# EAGLE design Smart_Lock_V1.00 (EAGLE 9.6.2)

## Sheet 1 of 6
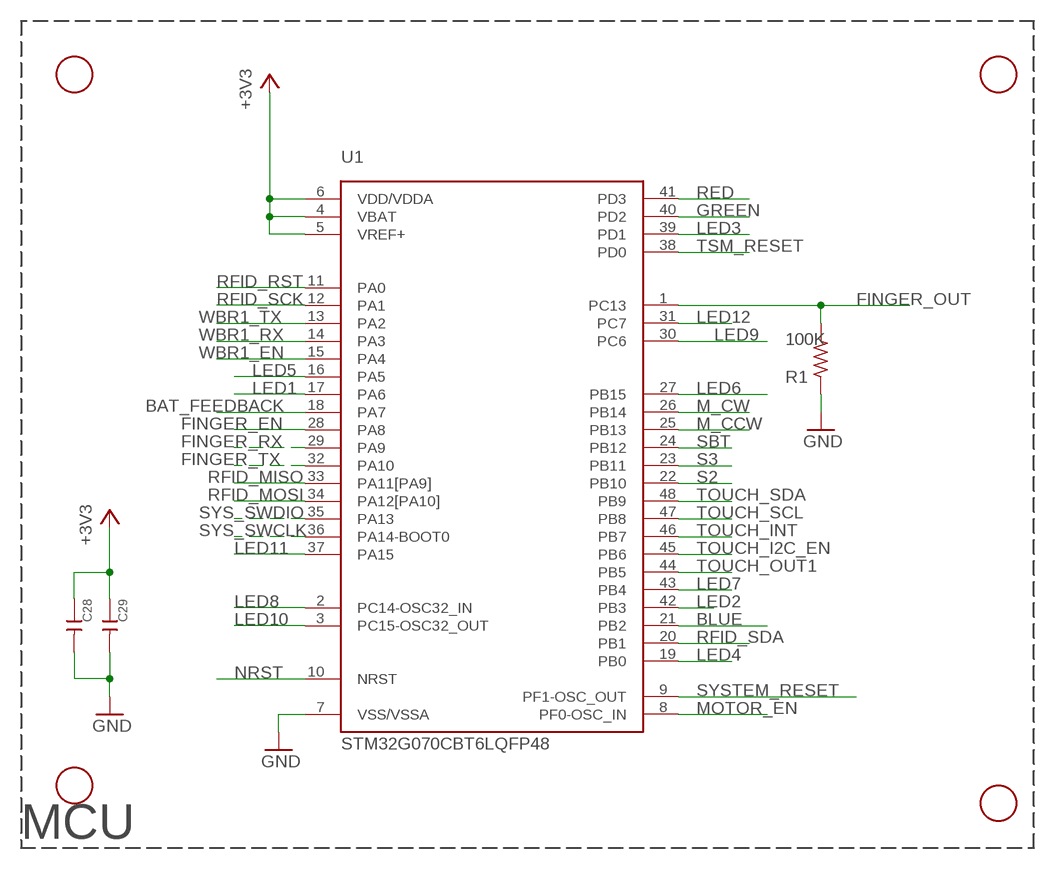
[diagram p0: schematic, sheet 1]

### Parts
C28  100nF  CERAMIC-100NF-50V-10%-X7R(0603)  [C0603]
C29  100nF  CERAMIC-100NF-50V-10%-X7R(0603)  [C0603]
F1  FIDUCIAL  [FIDUCIAL_1MM]
F2  FIDUCIAL  [FIDUCIAL_1MM]
F3  FIDUCIAL  [FIDUCIAL_1MM]
F4  FIDUCIAL  [FIDUCIAL_1MM]
R1  100K  R_0603  [R0603]
U1  STM32G070CBT6LQFP48  [LQFP48]

### Nets
+3V3: C28.1 C29.1 U1.4(VBAT) U1.5(VREF+) U1.6(VDD/VDDA) ; also sheet 2,3,4,5
BAT_FEEDBACK: U1.18(PA7) ; also sheet 4
BLUE: U1.21(PB2) ; also sheet 5
FINGER_EN: U1.28(PA8) ; also sheet 4
FINGER_OUT: R1.1 U1.1(PC13) ; also sheet 4
FINGER_RX: U1.29(PA9) ; also sheet 4
FINGER_TX: U1.32(PA10) ; also sheet 4
GND: C28.2 C29.2 R1.2 U1.7(VSS/VSSA) ; also sheet 2,3,4,5
GREEN: U1.40(PD2) ; also sheet 5
LED1: U1.17(PA6) ; also sheet 5
LED2: U1.42(PB3) ; also sheet 5
LED3: U1.39(PD1) ; also sheet 5
LED4: U1.19(PB0) ; also sheet 5
LED5: U1.16(PA5) ; also sheet 5
LED6: U1.27(PB15) ; also sheet 5
LED7: U1.43(PB4) ; also sheet 5
LED8: U1.2(PC14-OSC32_IN) ; also sheet 5
LED9: U1.30(PC6) ; also sheet 5
LED10: U1.3(PC15-OSC32_OUT) ; also sheet 5
LED11: U1.37(PA15) ; also sheet 5
LED12: U1.31(PC7) ; also sheet 5
M_CCW: U1.25(PB13) ; also sheet 4
M_CW: U1.26(PB14) ; also sheet 4
MOTOR_EN: U1.8(PF0-OSC_IN) ; also sheet 4
NRST: U1.10(NRST) ; also sheet 4
RED: U1.41(PD3) ; also sheet 5
RFID_MISO: U1.33(PA11[PA9]) ; also sheet 3
RFID_MOSI: U1.34(PA12[PA10]) ; also sheet 3
RFID_RST: U1.11(PA0) ; also sheet 3
RFID_SCK: U1.12(PA1) ; also sheet 3
RFID_SDA: U1.20(PB1) ; also sheet 3
S2: U1.22(PB10) ; also sheet 2
S3: U1.23(PB11) ; also sheet 2
SBT: U1.24(PB12) ; also sheet 2
SYS_SWCLK: U1.36(PA14-BOOT0) ; also sheet 4
SYS_SWDIO: U1.35(PA13) ; also sheet 4
SYSTEM_RESET: U1.9(PF1-OSC_OUT) ; also sheet 4
TOUCH_I2C_EN: U1.45(PB6) ; also sheet 2
TOUCH_INT: U1.46(PB7) ; also sheet 2
TOUCH_OUT1: U1.44(PB5) ; also sheet 2
TOUCH_SCL: U1.47(PB8) ; also sheet 2
TOUCH_SDA: U1.48(PB9) ; also sheet 2
TSM_RESET: U1.38(PD0) ; also sheet 2
WBR1_EN: U1.15(PA4) ; also sheet 4
WBR1_RX: U1.14(PA3) ; also sheet 4
WBR1_TX: U1.13(PA2) ; also sheet 4

### Notes on the sheet
- MCU

## Sheet 2 of 6
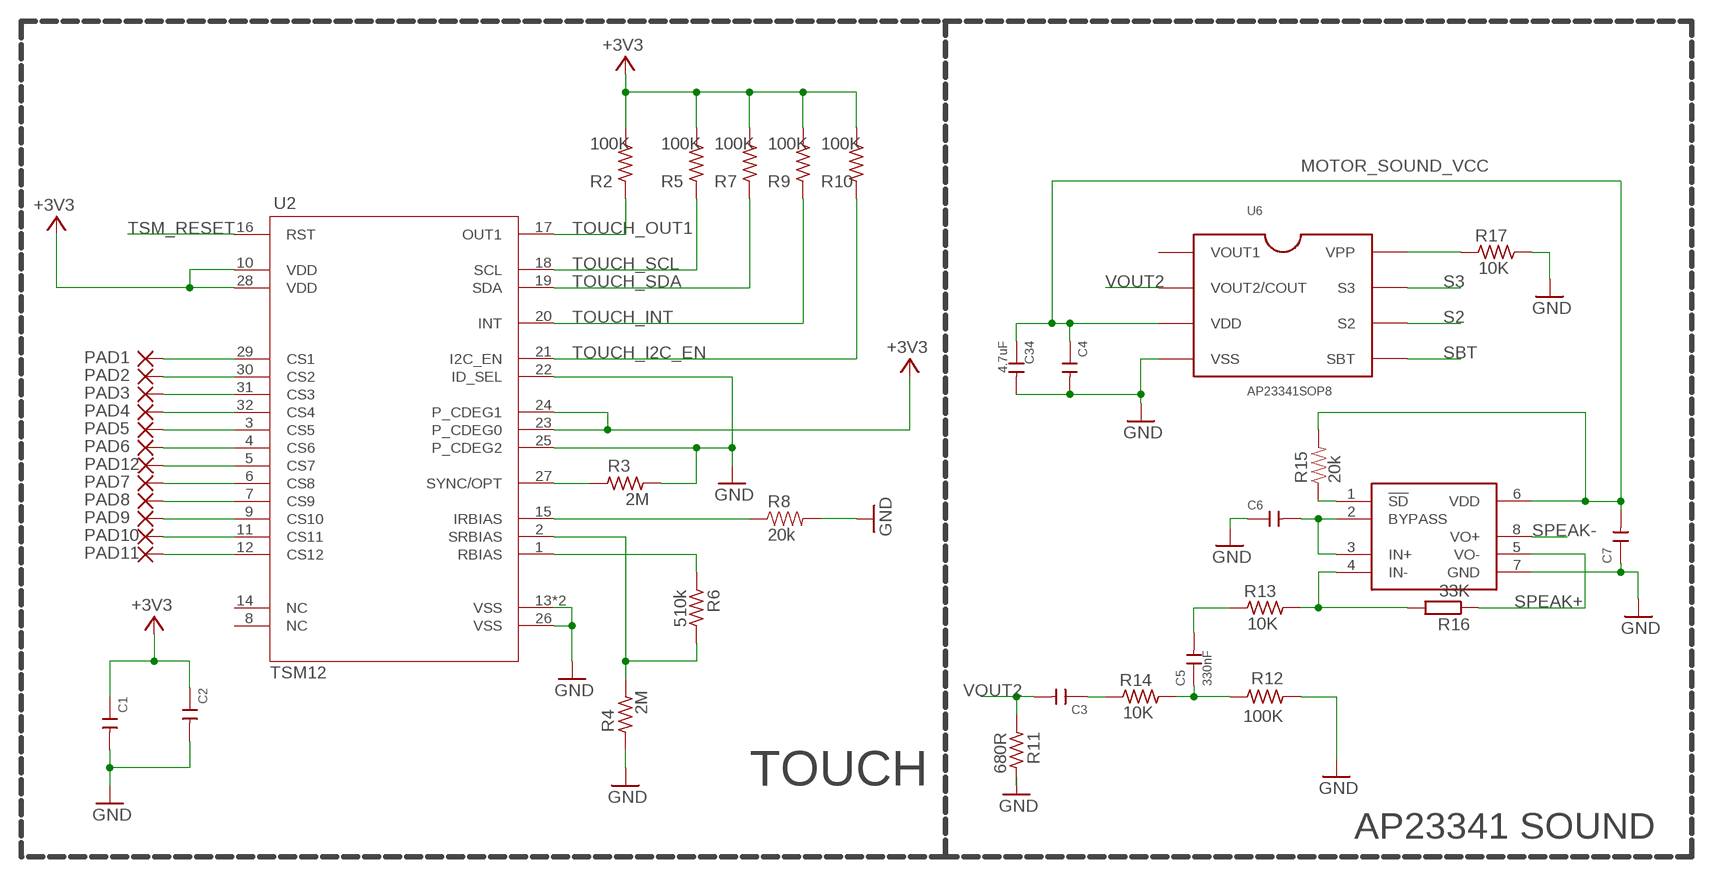
[diagram p1: schematic, sheet 2]

### Parts
C1  1uf  CERAMIC-1UF-25V-10%-X7R(0603)  [C0603]
C2  100nF  CERAMIC-100NF-50V-10%-X7R(0603)  [C0603]
C3  100nF  CERAMIC-100NF-50V-10%-X7R(0603)  [C0603]
C4  100nF  CERAMIC-100NF-50V-10%-X7R(0603)  [C0603]
C5  330nF  CERAMIC-10PF-50V-5%-NPO(0603)  [C0603]
C6  1uf  CERAMIC-1UF-25V-10%-X7R(0603)  [C0603]
C7  1uf  CERAMIC-1UF-25V-10%-X7R(0603)  [C0603]
C34  4.7uF  CERAMIC-10PF-50V-5%-NPO(0603)  [C0603]
PAD1  WIREPADSMD1,27-254  [SMD1,27-2,54]
PAD2  WIREPADSMD1,27-254  [SMD1,27-2,54]
PAD3  WIREPADSMD1,27-254  [SMD1,27-2,54]
PAD4  WIREPADSMD1,27-254  [SMD1,27-2,54]
PAD5  WIREPADSMD1,27-254  [SMD1,27-2,54]
PAD6  WIREPADSMD1,27-254  [SMD1,27-2,54]
PAD7  WIREPADSMD1,27-254  [SMD1,27-2,54]
PAD8  WIREPADSMD1,27-254  [SMD1,27-2,54]
PAD9  WIREPADSMD1,27-254  [SMD1,27-2,54]
PAD10  WIREPADSMD1,27-254  [SMD1,27-2,54]
PAD11  WIREPADSMD1,27-254  [SMD1,27-2,54]
PAD12  WIREPADSMD1,27-254  [SMD1,27-2,54]
R2  100K  R_0603  [R0603]
R3  2M  R_0603  [R0603]
R4  2M  R_0603  [R0603]
R5  100K  R_0603  [R0603]
R6  510k  R_0603  [R0603]
R7  100K  R_0603  [R0603]
R8  20k  20KOHM-0603-1/10W-5%  [0603]
R9  100K  R_0603  [R0603]
R10  100K  R_0603  [R0603]
R11  680R  R_0603  [R0603]
R12  100K  R_0603  [R0603]
R13  10K  R_0603  [R0603]
R14  10K  R_0603  [R0603]
R15  20k  20KOHM-0603-1/10W-5%  [0603]
R16  33K  R-EU_R0603  [R0603]
R17  10K  R_0603  [R0603]
U2  TSM12M  [QFN_32_UH]
U6  AP23341SOP8  [SOP8]
U7  AP4890  AP4890RM  [MSOP08]

### Nets
+3V3: C1.1 C2.1 R2.1 R5.1 R7.1 R9.1 R10.1 U2.10(VDD) U2.23(P_CDEG0) U2.24(P_CDEG1) U2.28(VDD) ; also sheet 1,3,4,5
GND: C1.2 C2.2 C4.2 C6.1 C7.1 C34.2 R3.2 R4.1 R8.2 R11.2 R12.2 R17.2 U2.13(VSS) U2.22(ID_SEL) U2.25(P_CDEG2) U2.26(VSS) U2.33(VSS) U6.4(VSS) U7.7(GND) ; also sheet 1,3,4,5
MOTOR_SOUND_VCC: C4.1 C7.2 C34.1 R15.2 U6.3(VDD) U7.6(VDD) ; also sheet 4
N$1: R17.1 U6.8(VPP)
N$2: R15.1 U7.1(!SD)
N$16: PAD3.1(P) U2.31(CS3)
N$23: C6.2 U7.2(BYPASS) U7.3(IN+)
N$25: C5.2 R13.1
N$26: R3.1 U2.27(SYNC/OPT)
N$27: R13.2 R16.2 U7.4(IN-)
N$29: C3.1 R14.1
N$30: PAD4.1(P) U2.32(CS4)
N$31: PAD5.1(P) U2.3(CS5)
N$32: PAD6.1(P) U2.4(CS6)
N$33: PAD2.1(P) U2.30(CS2)
N$34: PAD1.1(P) U2.29(CS1)
N$35: PAD7.1(P) U2.6(CS8)
N$36: PAD9.1(P) U2.9(CS10)
N$37: PAD10.1(P) U2.11(CS11)
N$38: R6.1 U2.1(RBIAS)
N$39: PAD11.1(P) U2.12(CS12)
N$40: R4.2 R6.2 U2.2(SRBIAS)
N$41: PAD12.1(P) U2.5(CS7)
N$42: R8.1 U2.15(IRBIAS)
N$43: PAD8.1(P) U2.7(CS9)
N$45: C5.1 R12.1 R14.2
S2: U6.6(S2) ; also sheet 1
S3: U6.7(S3) ; also sheet 1
SBT: U6.5(SBT) ; also sheet 1
SPEAK+: R16.1 U7.5(VO-) ; also sheet 4
SPEAK-: U7.8(VO+) ; also sheet 4
TOUCH_I2C_EN: R10.2 U2.21(I2C_EN) ; also sheet 1
TOUCH_INT: R9.2 U2.20(INT) ; also sheet 1
TOUCH_OUT1: R2.2 U2.17(OUT1) ; also sheet 1
TOUCH_SCL: R5.2 U2.18(SCL) ; also sheet 1
TOUCH_SDA: R7.2 U2.19(SDA) ; also sheet 1
TSM_RESET: U2.16(RST) ; also sheet 1
VOUT2: C3.2 R11.1 U6.2(VOUT2/COUT)
Unconnected: U2.8(NC) U2.14(NC) U6.1(VOUT1)

### Notes on the sheet
- TOUCH
- AP23341 SOUND

## Sheet 3 of 6
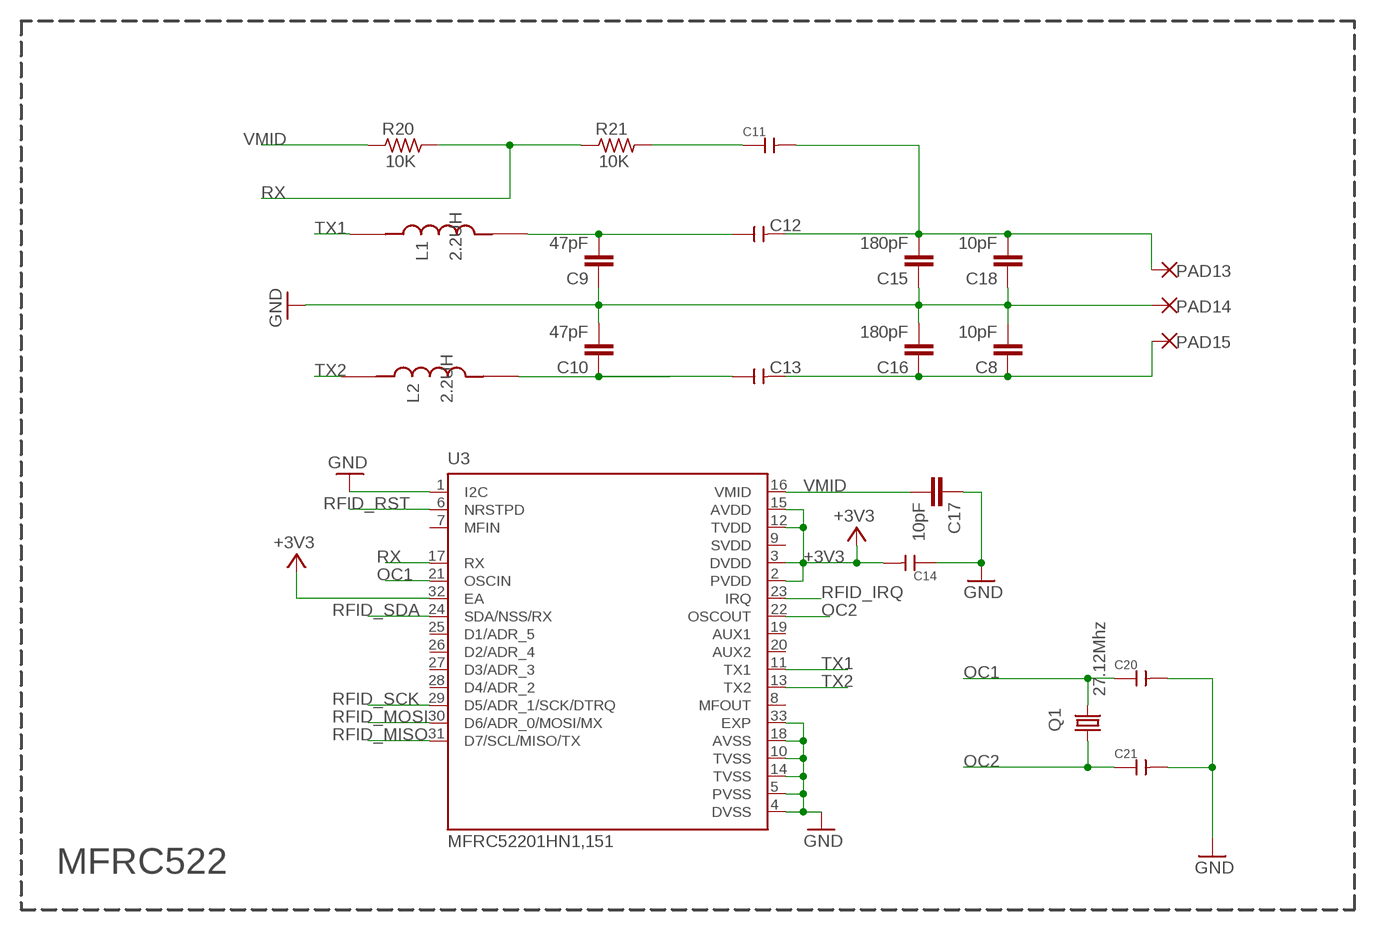
[diagram p2: schematic, sheet 3]

### Parts
C8  10pF  C-EUC0603  [C0603]
C9  47pF  C-EUC0603  [C0603]
C10  47pF  C-EUC0603  [C0603]
C11  100nF  CERAMIC-100NF-50V-10%-X7R(0603)  [C0603]
C12  15pf  CERAMIC-15PF-50V-5%-NPO(0603)  [C0603]
C13  15pf  CERAMIC-15PF-50V-5%-NPO(0603)  [C0603]
C14  100nF  CERAMIC-100NF-50V-10%-X7R(0603)  [C0603]
C15  180pF  C-EUC0603  [C0603]
C16  180pF  C-EUC0603  [C0603]
C17  10pF  C-EUC0603  [C0603]
C18  10pF  C-EUC0603  [C0603]
C20  15pf  CERAMIC-15PF-50V-5%-NPO(0603)  [C0603]
C21  15pf  CERAMIC-15PF-50V-5%-NPO(0603)  [C0603]
L1  2.2UH  MLF2012A2R2MT000  [INDC2012X105N]
L2  2.2UH  MLF2012A2R2MT000  [INDC2012X105N]
PAD13  WIREPADSMD5-1,8  [5-1,8]
PAD14  WIREPADSMD5-1,8  [5-1,8]
PAD15  WIREPADSMD5-1,8  [5-1,8]
Q1  27.12Mhz  KX-6  [2.5X2.0_KX-6]
R20  10K  R_0603  [R0603]
R21  10K  R_0603  [R0603]
U3  MFRC52201HN1,151  [QFN50P500X500X100-33N]

### Nets
+3V3: C14.2 U3.2(PVDD) U3.3(DVDD) U3.12(TVDD) U3.15(AVDD) U3.32(EA) ; also sheet 1,2,4,5
ANT: C11.2 C12.2 C15.2 C18.2 PAD13.1(P)
ANT2: C8.1 C13.2 C16.1 PAD15.1(P)
GND: C8.2 C9.1 C10.2 C14.1 C15.1 C16.2 C17.1 C18.1 C20.2 C21.2 PAD14.1(P) U3.1(I2C) U3.4(DVSS) U3.5(PVSS) U3.10(TVSS) U3.14(TVSS) U3.18(AVSS) U3.33(EXP) ; also sheet 1,2,4,5
N$55: C11.1 R21.2
N$56: C9.2 C12.1 L1.2
N$57: C10.1 C13.1 L2.2
OC1: C20.1 Q1.3 U3.21(OSCIN)
OC2: C21.1 Q1.1 U3.22(OSCOUT)
RFID_IRQ: U3.23(IRQ)
RFID_MISO: U3.31(D7/SCL/MISO/TX) ; also sheet 1
RFID_MOSI: U3.30(D6/ADR_0/MOSI/MX) ; also sheet 1
RFID_RST: U3.6(NRSTPD) ; also sheet 1
RFID_SCK: U3.29(D5/ADR_1/SCK/DTRQ) ; also sheet 1
RFID_SDA: U3.24(SDA/NSS/RX) ; also sheet 1
RX: R20.2 R21.1 U3.17(RX)
TX1: L1.1 U3.11(TX1)
TX2: L2.1 U3.13(TX2)
VMID: C17.2 R20.1 U3.16(VMID)
Unconnected: U3.7(MFIN) U3.8(MFOUT) U3.19(AUX1) U3.20(AUX2) U3.25(D1/ADR_5) U3.26(D2/ADR_4) U3.27(D3/ADR_3) U3.28(D4/ADR_2)

### Notes on the sheet
- MFRC522

## Sheet 4 of 6
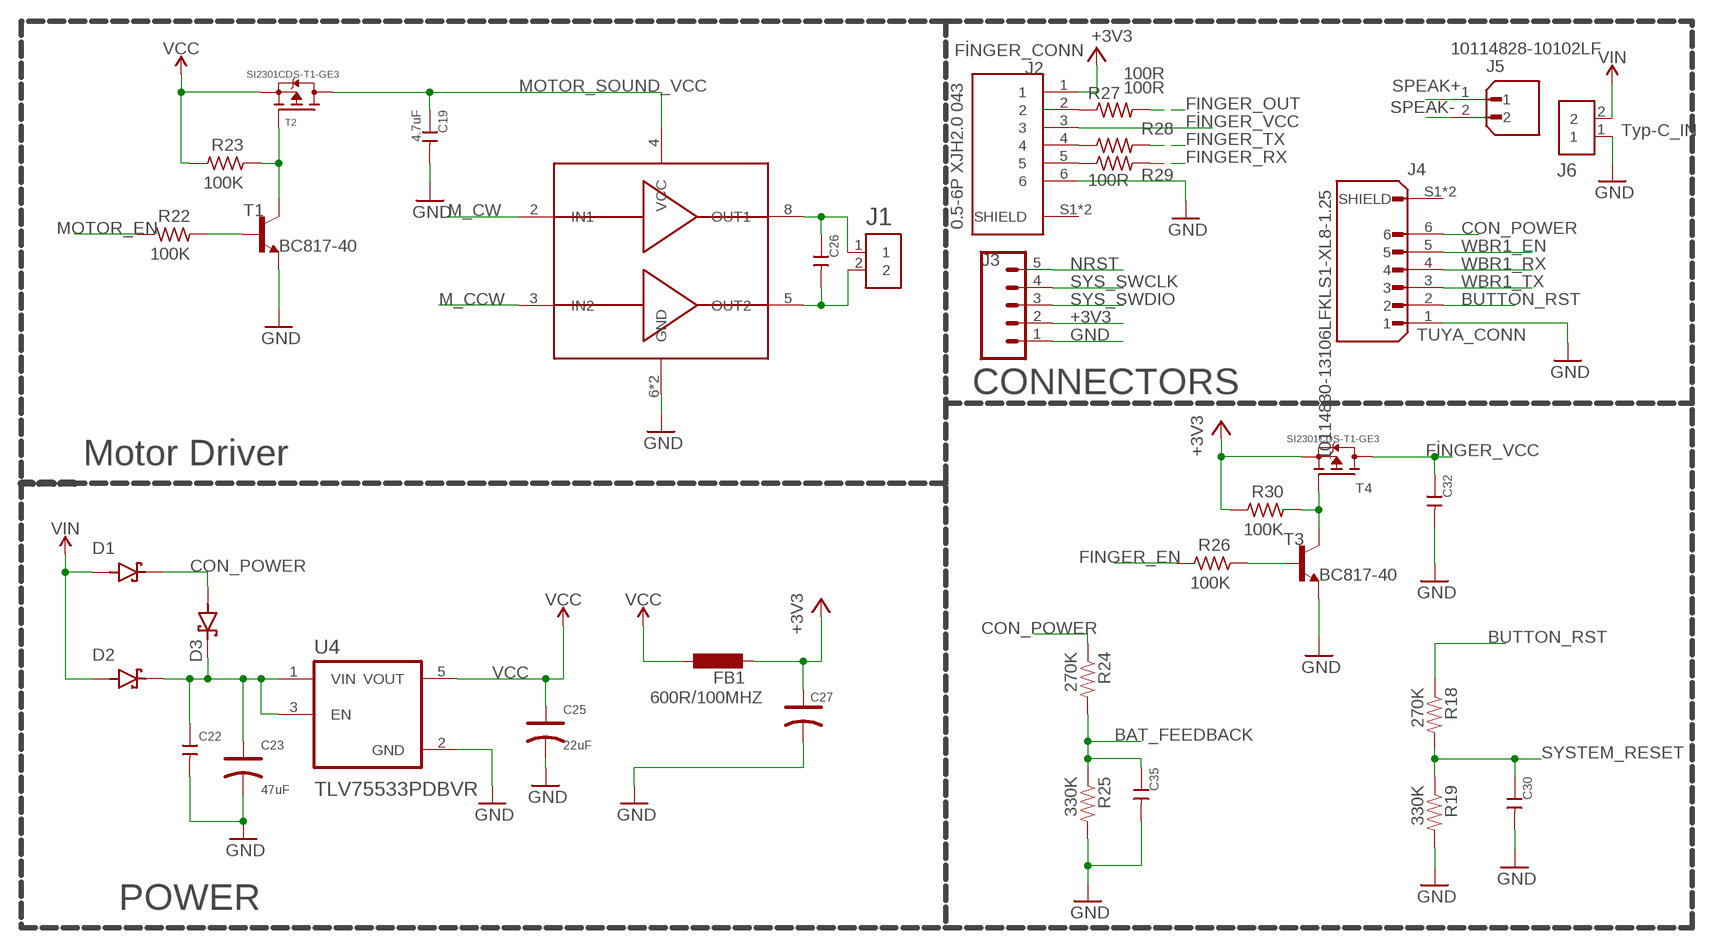
[diagram p3: schematic, sheet 4]

### Parts
C19  4.7uF  CERAMIC-10PF-50V-5%-NPO(0603)  [C0603]
C22  100nF  CERAMIC-100NF-50V-10%-X7R(0603)  [C0603]
C23  47uF  TANTALUM-SMD-47UF-16V-10%(AVX-B)  [AVX-B]
C25  22uF  TANTALUM-SMD-47UF-6.3V-10%(CT1206)  [CT1206]
C26  100nF  CERAMIC-100NF-50V-10%-X7R(0603)  [C0603]
C27  10uf  TANTALUM-SMD-10UF-16V-10%(AVX-B)  [AVX-B]
C30  100nF  CERAMIC-100NF-50V-10%-X7R(0603)  [C0603]
C32  100nF  CERAMIC-100NF-50V-10%-X7R(0603)  [C0603]
C35  100nF  CERAMIC-100NF-50V-10%-X7R(0603)  [C0603]
D1  1N5819HW-7-F  [SOD3715X145N]
D2  1N5819HW-7-F  [SOD3715X145N]
D3  1N5819HW-7-F  [SOD3715X145N]
FB1  600R/100MHZ  L-EUL2012C  [L2012C]
J1  B2B-PH-SM4-TB(LF)(SN)  [B2B-PH-SM4-TB(LF)(SN)]
J2  0.5-6P XJH2.0 043  68710614522  [WE_68710614522]
J3  CONN_05  [1X05]
J4  10114830-13106LFKLS1-XL8-1.25  [1X6PIN_1.25MM]
J5  10114828-10102LF  [AMPHENOL_10114828-10102LF]
J6  B2B-PH-SM4-TB(LF)(SN)  [B2B-PH-SM4-TB(LF)(SN)]
R18  270K  10KOHM-0603-1/10W-1%  [0603]
R19  330K  33KOHM-0603-1/10W-1%  [0603]
R22  100K  R_0603  [R0603]
R23  100K  R_0603  [R0603]
R24  270K  10KOHM-0603-1/10W-1%  [0603]
R25  330K  33KOHM-0603-1/10W-1%  [0603]
R26  100K  R_0603  [R0603]
R27  100R  R-US_R0402  [R0402]
R28  100R  R-US_R0402  [R0402]
R29  100R  R-US_R0402  [R0402]
R30  100K  R_0603  [R0603]
T1  BC817-40  BC817-40-NPN-SOT23-BEC  [SOT23-BEC]
T2  SI2301CDS-T1-GE3  [SOT-23]
T3  BC817-40  BC817-40-NPN-SOT23-BEC  [SOT23-BEC]
T4  SI2301CDS-T1-GE3  [SOT-23]
U4  TLV75533PDBVR  [SOT95P285X140-5N]
U5  TC118S8  [SO08]

### Nets
+3V3: C27.+ FB1.2 J2.1 J3.2 R30.1 T4.2(S) ; also sheet 1,2,3,5
BAT_FEEDBACK: C35.1 R24.2 R25.1 ; also sheet 1
BUTTON_RST: J4.2 R18.1
CON_POWER: D1.C(K) D3.A J4.6 R24.1
FINGER_EN: R26.1 ; also sheet 1
FINGER_OUT: R27.2 ; also sheet 1
FINGER_RX: R29.2 ; also sheet 1
FINGER_TX: R28.2 ; also sheet 1
FİNGER_VCC: C32.1 J2.3 T4.3(D)
GND: C19.2 C22.2 C23.- C25.- C27.- C30.2 C32.2 C35.2 J2.6 J3.1 J4.1 J6.1 R19.2 R25.2 T1.E T3.E U4.2(GND) U5.6(GND) U5.7(GND) ; also sheet 1,2,3,5
M_CCW: U5.3(IN2) ; also sheet 1
M_CW: U5.2(IN1) ; also sheet 1
MOTOR_EN: R22.1 ; also sheet 1
MOTOR_SOUND_VCC: C19.1 T2.3(D) U5.4(VCC) ; also sheet 2
N$6: C22.1 C23.+ D2.C(K) D3.C(K) U4.1(VIN) U4.3(EN)
N$9: C26.1 J1.1 U5.8(OUT1)
N$21: R26.2 T3.B
N$24: C26.2 J1.2 U5.5(OUT2)
N$28: R30.2 T3.C T4.1(G)
N$44: R22.2 T1.B
N$48: R23.2 T1.C T2.1(G)
N$53: J2.2 R27.1
N$54: J2.4 R28.1
N$58: J2.5 R29.1
NRST: J3.5 ; also sheet 1
SPEAK+: J5.1 ; also sheet 2
SPEAK-: J5.2 ; also sheet 2
SYS_SWCLK: J3.4 ; also sheet 1
SYS_SWDIO: J3.3 ; also sheet 1
SYSTEM_RESET: C30.1 R18.2 R19.1 ; also sheet 1
VCC: C25.+ FB1.1 R23.1 T2.2(S) U4.5(VOUT)
VIN: D1.A D2.A J6.2
WBR1_EN: J4.5 ; also sheet 1
WBR1_RX: J4.4 ; also sheet 1
WBR1_TX: J4.3 ; also sheet 1
Unconnected: J2.S1(SHIELD) J2.S2(SHIELD) J4.S1(SHIELD) J4.S2(SHIELD)

### Notes on the sheet
- FİNGER_CONN
- Typ-C_IN
- TUYA_CONN
- CONNECTORS
- Motor Driver
- POWER

## Sheet 5 of 6
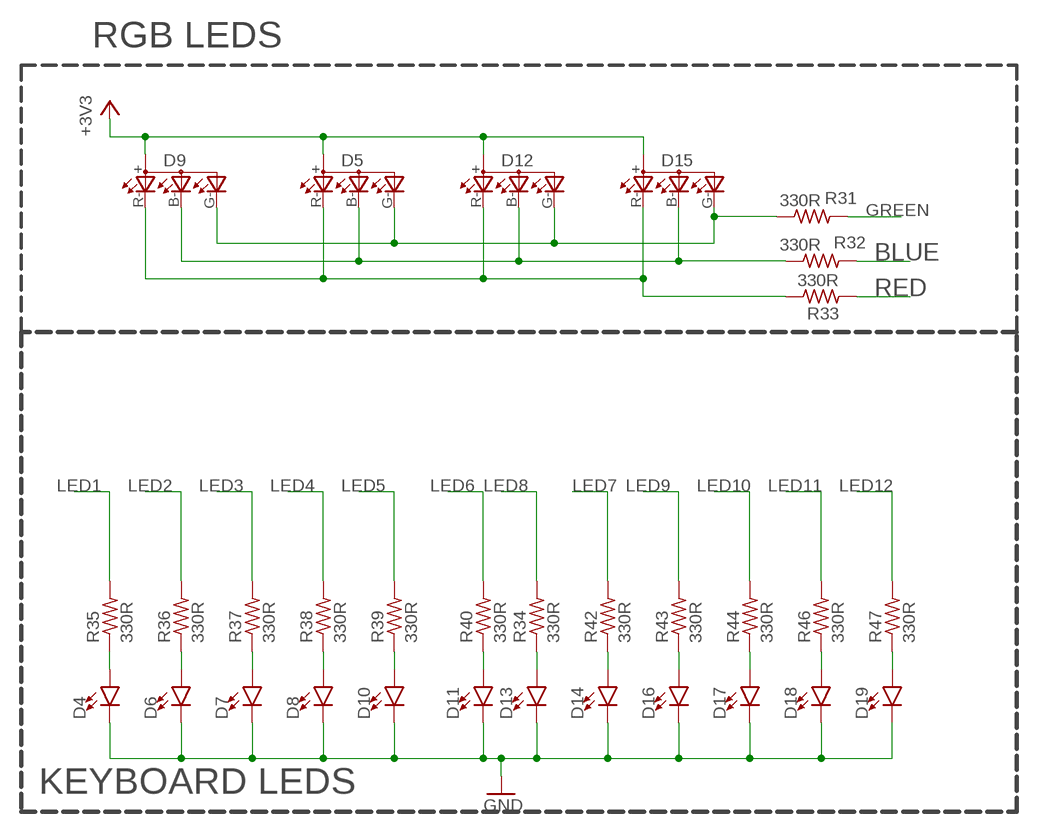
[diagram p4: schematic, sheet 5]

### Parts
D4  HL-PST-1608H233W-HF4  LED-BLUE-0603-WE  [LED-0603]
D5  FM-3510RGBA-SG  RGBA_LEDSMD,1.3X3.5MM  [SMD-4P,1X3MM]
D6  HL-PST-1608H233W-HF4  LED-BLUE-0603-WE  [LED-0603]
D7  HL-PST-1608H233W-HF4  LED-BLUE-0603-WE  [LED-0603]
D8  HL-PST-1608H233W-HF4  LED-BLUE-0603-WE  [LED-0603]
D9  FM-3510RGBA-SG  RGBA_LEDSMD,1.3X3.5MM  [SMD-4P,1X3MM]
D10  HL-PST-1608H233W-HF4  LED-BLUE-0603-WE  [LED-0603]
D11  HL-PST-1608H233W-HF4  LED-BLUE-0603-WE  [LED-0603]
D12  FM-3510RGBA-SG  RGBA_LEDSMD,1.3X3.5MM  [SMD-4P,1X3MM]
D13  HL-PST-1608H233W-HF4  LED-BLUE-0603-WE  [LED-0603]
D14  HL-PST-1608H233W-HF4  LED-BLUE-0603-WE  [LED-0603]
D15  FM-3510RGBA-SG  RGBA_LEDSMD,1.3X3.5MM  [SMD-4P,1X3MM]
D16  HL-PST-1608H233W-HF4  LED-BLUE-0603-WE  [LED-0603]
D17  HL-PST-1608H233W-HF4  LED-BLUE-0603-WE  [LED-0603]
D18  HL-PST-1608H233W-HF4  LED-BLUE-0603-WE  [LED-0603]
D19  HL-PST-1608H233W-HF4  LED-BLUE-0603-WE  [LED-0603]
R31  330R  R_0603  [R0603]
R32  330R  R_0603  [R0603]
R33  330R  R_0603  [R0603]
R34  330R  R-US_R0402  [R0402]
R35  330R  R-US_R0402  [R0402]
R36  330R  R-US_R0402  [R0402]
R37  330R  R-US_R0402  [R0402]
R38  330R  R-US_R0402  [R0402]
R39  330R  R-US_R0402  [R0402]
R40  330R  R-US_R0402  [R0402]
R42  330R  R-US_R0402  [R0402]
R43  330R  R-US_R0402  [R0402]
R44  330R  R-US_R0402  [R0402]
R46  330R  R-US_R0402  [R0402]
R47  330R  R-US_R0402  [R0402]

### Nets
+3V3: D5.+(A) D9.+(A) D12.+(A) D15.+(A) ; also sheet 1,2,3,4
BLUE: R32.2 ; also sheet 1
GND: D4.C D6.C D7.C D8.C D10.C D11.C D13.C D14.C D16.C D17.C D18.C D19.C ; also sheet 1,2,3,4
GREEN: R31.2 ; also sheet 1
LED1: R35.2 ; also sheet 1
LED2: R36.2 ; also sheet 1
LED3: R37.2 ; also sheet 1
LED4: R38.2 ; also sheet 1
LED5: R39.2 ; also sheet 1
LED6: R40.2 ; also sheet 1
LED7: R42.2 ; also sheet 1
LED8: R34.2 ; also sheet 1
LED9: R43.2 ; also sheet 1
LED10: R44.2 ; also sheet 1
LED11: R46.2 ; also sheet 1
LED12: R47.2 ; also sheet 1
N$3: D13.A R34.1
N$4: D5.G-(CGREEN) D9.G-(CGREEN) D12.G-(CGREEN) D15.G-(CGREEN) R31.1
N$5: D5.B-(CBLUE) D9.B-(CBLUE) D12.B-(CBLUE) D15.B-(CBLUE) R32.1
N$7: D4.A R35.1
N$8: D6.A R36.1
N$10: D5.R-(CRED) D9.R-(CRED) D12.R-(CRED) D15.R-(CRED) R33.1
N$11: D7.A R37.1
N$12: D8.A R38.1
N$13: D10.A R39.1
N$14: D11.A R40.1
N$15: D14.A R42.1
N$17: D16.A R43.1
N$18: D17.A R44.1
N$19: D18.A R46.1
N$20: D19.A R47.1
RED: R33.2 ; also sheet 1

### Notes on the sheet
- RGB LEDS
- KEYBOARD LEDS

## Sheet 6 of 6
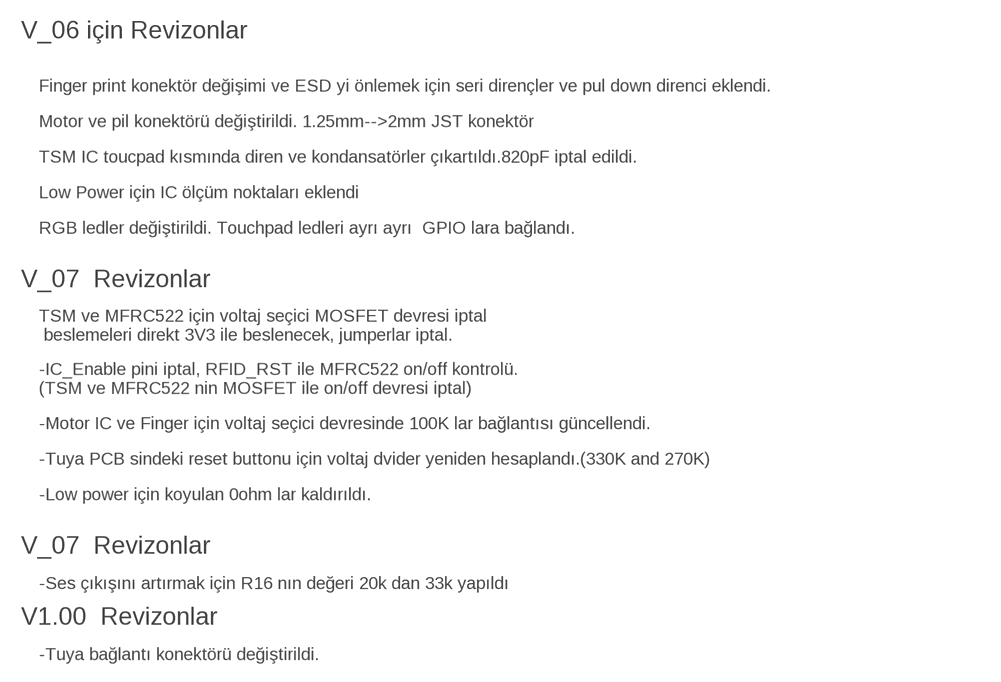
[diagram p5: schematic, sheet 6]

### Notes on the sheet
- V_06 için Revizonlar
- Finger print konektör değişimi ve ESD yi önlemek için seri dirençler ve pul down direnci eklendi.
- Motor ve pil konektörü değiştirildi. 1.25mm-->2mm JST konektör
- TSM IC toucpad kısmında diren ve kondansatörler çıkartıldı.820pF iptal edildi.
- Low Power için IC ölçüm noktaları eklendi
- RGB ledler değiştirildi. Touchpad ledleri ayrı ayrı  GPIO lara bağlandı.
- V_07  Revizonlar
- TSM ve MFRC522 için voltaj seçici MOSFET devresi iptal
   beslemeleri direkt 3V3 ile beslenecek, jumperlar iptal.
- -IC_Enable pini iptal, RFID_RST ile MFRC522 on/off kontrolü.
  (TSM ve MFRC522 nin MOSFET ile on/off devresi iptal)
- -Motor IC ve Finger için voltaj seçici devresinde 100K lar bağlantısı güncellendi.
- -Tuya PCB sindeki reset buttonu için voltaj dvider yeniden hesaplandı.(330K and 270K)
- -Low power için koyulan 0ohm lar kaldırıldı.
- V_07  Revizonlar
- -Ses çıkışını artırmak için R16 nın değeri 20k dan 33k yapıldı
- V1.00  Revizonlar
- -Tuya bağlantı konektörü değiştirildi.

## Power pins joined to a net without a drawn wire
SVDD: U3.9(SVDD)

## Library data of the parts
C1 C6 C7 = Seeed-OPL-Capacitor:CERAMIC-1UF-25V-10%-X7R(0603): 302010139; DESCRIPTION: 50V 1uF X5R ±10% 0603 Multilayer Ceramic Capacitors MLCC - SMD/SMT ROHS; MF: Samsung Electro-Mechanics; MP: CL10A105KB8NNNC; PACKAGE: 0603
C2-C4 C11 C14 C22 C26 C28-C30 C32 C35 = Seeed-OPL-Capacitor:CERAMIC-100NF-50V-10%-X7R(0603): 302010138; DESCRIPTION: 50V 100nF X7R ±5% 0603 Multilayer Ceramic Capacitors MLCC - SMD/SMT ROHS; MF: YAGEO; MP: CC0603KRX7R9BB104; PACKAGE: 0603
C5 = Seeed-OPL-Capacitor:CERAMIC-10PF-50V-5%-NPO(0603): 302010097; DESCRIPTION: X7R 330nF 50V ±20% 0603 Multilayer Ceramic Capacitors MLCC - SMD/SMT ROHS; MF: CCTC; MP: TCC0603X7R334M500CT; PACKAGE: 0603; VALUE: 10pf
C8 C17 C18 = rcl:C-EU: CAPACITOR, European symbol; DESCRIPTION: 50V 10pF C0G ±5% 0603 Multilayer Ceramic Capacitors MLCC - SMD/SMT ROHS; MF: FOJAN; MP: FCC0603N100J500CT; PACKAGE: 0603
C9 C10 = rcl:C-EU: CAPACITOR, European symbol; DESCRIPTION: NP0 50V 47pF ±5% 0603 Multilayer Ceramic Capacitors MLCC - SMD/SMT ROHS; MF: FOJAN; MP: CC0603JRNPO9BN470; PACKAGE: 0603
C12 C13 C20 C21 = Seeed-OPL-Capacitor:CERAMIC-15PF-50V-5%-NPO(0603): 302010082; DESCRIPTION: 50V 15pF NP0 ±5% 0603 Multilayer Ceramic Capacitors MLCC - SMD/SMT ROHS; MF: YAGEO; MP: CC0603JRNPO9BN150; PACKAGE: 0603
C15 C16 = rcl:C-EU: CAPACITOR, European symbol; DESCRIPTION: 50V 180pF NP0 ±5% 0603 Multilayer Ceramic Capacitors MLCC - SMD/SMT ROHS; MF: YAGEO; MP: CC0603JRNPO9BN181; PACKAGE: 0603
C19 C34 = Seeed-OPL-Capacitor:CERAMIC-10PF-50V-5%-NPO(0603): 302010097; DESCRIPTION: X5R 4.7uF 16V ±10% 0603 Multilayer Ceramic Capacitors MLCC - SMD/SMT ROHS; MF: CCTC; MP: TCC0603X5R475K160CT; PACKAGE: 0603; VALUE: 10pf
C23 = Seeed-OPL-Capacitor:TANTALUM-SMD-47UF-16V-10%(AVX-B): 302020020; DESCRIPTION: 47uF 10V 1Ω@100kHz ±10% CASE-B-3528 Tantalum Capacitors ROHS; MF: Kyocera AVX; MP: TAJB476K010RNJ; MPN: TAJB476K010RNJ; PACKAGE: CASE-B-3528; SPICEPREFIX: C; VALUE: 47uf
C25 = Seeed-OPL-Capacitor:TANTALUM-SMD-47UF-6.3V-10%(CT1206): 302020042; DESCRIPTION: 22uF 16V 2.9Ω@100kHz ±20% 1206 Tantalum Capacitors ROHS; MF: Vishay Intertech; MP: TMCMA1C226MTRF; MPN: TACA476*006#TA; PACKAGE: 1206; VALUE: 47UF 6.3V
C27 = Seeed-OPL-Capacitor:TANTALUM-SMD-10UF-16V-10%(AVX-B): 302020019; DESCRIPTION: 10uF 16V 2.8Ω@100kHz ±10% CASE-B-3528 Tantalum Capacitors ROHS; MF: Kyocera AVX; MP: TAJB106K016RNJ; PACKAGE: CASE-B-3528
D1-D3 = Smart_lock:1N5819HW-7-F: 1N5819HW Series 40 V 1 A Surface Mount Schottky Barrier Rectifier - SOD-123 Check availability <https://pricing.snapeda.com/parts/1N5819HW-7-F/Multicomp/view-part?ref=eda>; AVAILABILITY: In Stock; DESCRIPTION: Diyot Schottky 40V 1A Yüzey Montajlı SOD-123; MF: Multicomp; MP: 1N5819HW-7-F; PACKAGE: SOD-123 Multicomp; PRICE: None; SPICEPREFIX: D
D4 D6-D8 D10 D11 D13 D14 D16-D19 = SparkFun-LED:LED-BLUE: Blue SMD LED Used in manufacturing of various products at SparkFun Packages: 0603 - SMD 0603 package [Product Link] <http://www.digikey.com/product-detail/en/SMLE12BC7TT86/511-1589-2-ND/1641808> 1206 - SMD1206 package [Product Link] <http://www.digikey.com/product-detail/en/lite-on-inc/LTST-C150TBKT/160-1643-1-ND/573584> SparkFun Products: ESP8266 Thing-Dev Board <https://www.sparkfun.com/products/13711> RedBoard <https://www.sparkfun.com/products/12757>; DESCRIPTION: 90mW -40℃~+80℃ 20mA White 120° 15000K~20000K 0603 LED Indication - Discrete ROHS; MF: TUOZHAN; MP: TZ0603W3G-001/6#; PACKAGE: 0603; PROD_ID: DIO-16513; VALUE: Blue
D5 D9 D12 D15 = Smart_lock:RGBA_LED; DESCRIPTION: SMD,1.3x3.5mm RGB LEDs ROHS; MF: Foshan NationStar Optoelectronics; MP: FM-3510RGBA-SG; PACKAGE: SMD,1.3x3.5mm
F1-F4 = adafruit:FIDUCIAL: For use by pick and place machines to calibrate the vision/machine, 1mm By microbuilder.eu
FB1 = rcl:L-EU: INDUCTOR, European symbol; DESCRIPTION: 500mΩ ±25% 600Ω@100MHz 0805 Ferrite Beads ROHS; MF: TE Connectivity; MP: BMB2A0600RS2; PACKAGE: 0805
J1 J6 = Smart_lock:B2B-PH-SM4-TB(LF)(SN): Check availability <https://pricing.snapeda.com/parts/B2B-PH-SM4-TB%28LF%29%28SN%29/JST%20Sales/view-part?ref=eda>; AVAILABILITY: In Stock; CHECK_PRICES: https://www.snapeda.com/parts/B2B-PH-SM4-TB(LF)(SN)/JST+Sales+America+Inc./view-part/?ref=eda; DESCRIPTION: Connector Header Surface Mount 2 position 0.079 (2.00mm); MF: JST Sales; MP: B2B-PH-SM4-TB(LF)(SN); PACKAGE: NON STANDARD-2 JST; PRICE: None; SNAPEDA_LINK: https://www.snapeda.com/parts/B2B-PH-SM4-TB(LF)(SN)/JST+Sales+America+Inc./view-part/?ref=snap
J2 = Smart_lock:68710614522: CONN FPC BOTTOM 6POS 0.50MM R/A Check availability <https://pricing.snapeda.com/parts/68710614522/Wurth%20Elektronik/view-part?ref=eda>; DESCRIPTION: 6 Position FPC Connector Contacts, Bottom 0.020 (0.50mm) Surface Mount, Right Angle; MF: SHOU HAN; MP: 0.5-6P XJH2.0 043; PACKAGE: SMD,P=0.5mm,
J3 = SparkFun-Connectors:CONN_05: Multi connection point. Often used as Generic Header-pin footprint for 0.1 inch spaced/style header connections On any of the 0.1 inch spaced packages, you can populate with these: Break Away Headers - Straight <https://www.sparkfun.com/products/116> (PRT-00116) Break Away Male Headers - Right Angle <https://www.sparkfun.com/products/553> (PRT-00553) Female Headers <https://www.sparkfun.com/products/115> (PRT-00115) Break Away Headers - Machine Pin <https://www.sparkfun.com/products/117> (PRT-00117) Break Away Female Headers - Swiss Machine Pin <https://www.sparkfun.com/products/743> (PRT-00743) For SCREWTERMINALS and SPRING TERMINALS visit here: Screw Terimnals on SparkFun.com <https://www.sparkfun.com/search/results?term=Screw+Terminals> (5mm/3.5mm/2.54mm spacing) This device is also useful as a general connection point to wire up your design to another part of your project. Our various solder wires solder well into these plated through hole pads. Hook-Up Wire - Assortment (Stranded, 22 AWG) <https://www.sparkfun.com/products/11375> (PRT-11375) Hook-Up Wire - Assortment (Solid Core, 22 AWG) <https://www.sparkfun.com/products/11367> (PRT-11367) View the entire wire category on our website here <https://www.sparkfun.com/categories/141> Special notes: Molex polarized connector foot print use with SKU : PRT-08231 with associated crimp pins and housings. 1MM SMD Version SKU: PRT-10208
J4 = Smart_lock:10114830-13106LF: Check availability <https://pricing.snapeda.com/parts/10114830-13106LF/Amphenol%20ICC%20%28FCI%29/view-part?ref=eda>
J5 = Smart_lock:10114828-10102LF: Check availability <https://pricing.snapeda.com/parts/10114828-10102LF/Amphenol%20ICC/view-part?ref=eda>; DESCRIPTION: 1x2P 2P 1 Tin 1.25mm 2 -40℃~+105℃ Copper Alloy 1A Vertical welding SMD,P=1.25mm Wire To Board Connector ROHS; MF: Hong Cheng; MP: HCZZ0015-2; PACKAGE: SMD,P=1.25mm
L1 L2 = Smart_lock:MLF2012A2R2MT000: 2.2µH Shielded Multilayer Inductor 50mA 500mOhm Max 0805 (2012 Metric) Check availability <https://pricing.snapeda.com/parts/MLF2012A2R2MT000/TDK/view-part?ref=eda>; DESCRIPTION: 2.2 µH Shielded Multilayer Inductor 50 mA 500mOhm Max 0805 (2012 Metric); MF: TDK; MP: MLF2012A2R2MT000; PACKAGE: 2012 Bourns
PAD1-PAD12 = wirepad2:WIREPAD: Wire PAD connect wire on PCB
PAD13-PAD15 = wirepad:WIREPAD: Wire PAD connect wire on PCB
Q1 = crystal-geyer_V1_0:KX: Quartz Crystals (MHz) SMD: KX - Serie Model Size l/w/h [mm] Frequency Range Frequency Stability Temp. Range [°C] Load Capacitance AECQ 200 availabel Datasheet KX-4 KX-5 KX-6 KX-7 KX-9A KX-9B KX-12A KX-12B KX-13 KX-20 KX-K KX-KS 1.6/1.2/0.3 2.0/1.6/0.45 2.5/2.0/0.55 3.2/2.5/0.8 5.0/3.2/1.0 5.0/3.2/1.1 6.0/3.5/1.1 6.0/3.5/1.0 7.0/5.0 /1.3 11.6/5.5/1.6 12.3/4.5/4.2 12.3/4.5/3.2 24.0 ~ 80.0 MHz 16.0 ~ 80.0 MHz 12.0 ~ 80.0 MHz 8.0 ~ 60.0 MHz 7,68 ~ 300,0 MHz 8,0 ~ 50,0 MHz 8,0 ~ 150,0 MHz 8,0 ~ 50,0 MHz 6,0 ~ 160,0 MHz 3,579 ~ 25,0 MHz 3,579 ~ 70,0 MHz 3,579 ~ 70,0 MHz ±10 … ±50ppm ±10 … ±50ppm ±10 … ±50ppm ±10 … ±50ppm ±10 … ±50ppm ±10 … ±50ppm ±10 … ±50ppm ±10 … ±50ppm ±10 … ±50ppm ±50ppm ±10 … ±50ppm ±10 … ±50ppm (*) -40°C …+85°C (*) -40°C …+125°C (*) -40°C …+125°C (*) -40°C …+125°C (*) -40°C …+105°C (*) -40°C …+105°C (*) -40°C …+125°C (*) -40°C …+105°C (*) -40°C …+105°C (*) -40°C …+105°C (*) -40°C …+85°C (*) -40°C …+85°C 8, 8…16 8, 8…16 10, 8…16 12, 7…20 16, 10…20 16, 10…20 16, 10…20 16, 12…20 16, 12…20 16, 12…20 16, 12…30 16, 12…30 - yes yes yes - - - - - - - - KX-4.pdf <http://www.geyer-electronic.de/uploads/tx_userartikelfrequenz/GEYER-KX-4.pdf> KX-5.pdf <http://www.geyer-electronic.de/uploads/tx_userartikelfrequenz/GEYER-KX-5.pdf> KX-6.pdf <http://www.geyer-electronic.de/uploads/tx_userartikelfrequenz/GEYER-KX-6.pdf> KX-7.pdf <http://www.geyer-electronic.de/uploads/tx_userartikelfrequenz/GEYER-KX-7.pdf> KX-9A.pdf <http://www.geyer-electronic.de/uploads/tx_userartikelfrequenz/GEYER-KX-9A.pdf> KX-9B.pdf <http://www.geyer-electronic.de/uploads/tx_userartikelfrequenz/GEYER-KX-9B.pdf> KX-12A.pdf <http://www.geyer-electronic.de/uploads/tx_userartikelfrequenz/GEYER-KX-12A.pdf> KX-12B.pdf <http://www.geyer-electronic.de/uploads/tx_userartikelfrequenz/GEYER-KX-12B.pdf> KX-13.pdf <http://www.geyer-electronic.de/uploads/tx_userartikelfrequenz/GEYER-KX-13.pdf> KX-20.pdf <http://www.geyer-electronic.de/uploads/tx_userartikelfrequenz/GEYER-KX-20.pdf> KX-K.pdf <http://www.geyer-electronic.de/uploads/tx_userartikelfrequenz/GEYER-KX-K.pdf> KX-KS.pdf <http://www.geyer-electronic.de/uploads/tx_userartikelfrequenz/GEYER-KX-KS.pdf> <http://www.geyer-electronic.de/fileadmin/template/img/logo-geyer-electronic.png> Details see: http://www.geyer-electronic.de/Frequenz-Produkte.9.0.html Created 2016-06-07, Hans Locher 2016 (C) Geyer Quartz Technology KX4,KX5,KX6,KX7,KX9A,KX9B,KX12A,KX12B,KX13,KX20,KXK,KXKS;1612;2016;2520;3225;5032;6035;7050;11655;12345;1,6x1,2;2,0x1,6;2,5x2,0;3,2x2,5;5,0x3,2;6,0x3,5;7,0x5,0;11,6x5,5;12,3x4,5;12,3x4,5;1.6x1.2;2.0x1.6;2.5x2.0;3.2x2.5;5.0x3.2;6.0x3.5;7.0x5.0;11.6x5.5;12.3x4.5;12.3x4.5;; DESCRIPTION: 12pF 27.12MHz ±10ppm SMD3225-4P Crystals ROHS; MF: JGHC; MP: S3227120121040; PACKAGE: SMD3225-4P
R1 R2 R5 R7 R9 R10 R12 R22 R23 R26 R30 = cap_master-smd:R_: RESISTOR; DESCRIPTION: 100mW Thick Film Resistors 75V ±100ppm/℃ ±5% 100kΩ 0603 Chip Resistor - Surface Mount ROHS; MF: FOJAN; MP: FRC0603J104 TS; PACKAGE: 0603
R3 R4 = cap_master-smd:R_: RESISTOR; DESCRIPTION: 2MΩ 100mW 75V Thick Film Resistors ±5% ±100ppm/℃ 0603 Chip Resistor - Surface Mount ROHS; MF: FOJAN; MP: FRC0603J205 TS; PACKAGE: 0603
R6 = cap_master-smd:R_: RESISTOR; DESCRIPTION: 100mW 510kΩ 75V Thick Film Resistors ±5% ±100ppm/℃ 0603 Chip Resistor - Surface Mount ROHS; MF: FOJAN; MP: FRC0603J514 TS; PACKAGE: 0603
R8 R15 = SparkFun-Resistors:20KOHM: 20kΩ resistor A resistor is a passive two-terminal electrical component that implements electrical resistance as a circuit element. Resistors act to reduce current flow, and, at the same time, act to lower voltage levels within circuits. - Wikipedia; DESCRIPTION: 100mW Thick Film Resistors 75V ±100ppm/℃ ±5% 20kΩ 0603 Chip Resistor - Surface Mount ROHS; MF: FOJAN; MP: FRC0603J203 TS; PACKAGE: 0603; PROD_ID: RES-09231
R11 = cap_master-smd:R_: RESISTOR; DESCRIPTION: 100mW Thick Film Resistors 75V ±5% 680Ω 0603 Chip Resistor - Surface Mount ROHS; MF: VO; MP: SCR0603J680R; PACKAGE: 0603
R13 R14 R17 = cap_master-smd:R_: RESISTOR; DESCRIPTION: 100mW Thick Film Resistors 75V ±100ppm/℃ ±5% 10kΩ 0603 Chip Resistor - Surface Mount ROHS; MF: FOJAN; MP: FRC0603J103TS; PACKAGE: 0603
R16 = rcl:R-EU_: RESISTOR, European symbol; DESCRIPTION: 100mW Thick Film Resistors 75V ±100ppm/℃ ±5% 33kΩ 0603 Chip Resistor - Surface Mount ROHS; MF: FOJAN; MP: FRC0603J333 TS; PACKAGE: 0603
R18 R24 = SparkFun-Resistors:10KOHM: 10kΩ resistor A resistor is a passive two-terminal electrical component that implements electrical resistance as a circuit element. Resistors act to reduce current flow, and, at the same time, act to lower voltage levels within circuits. - Wikipedia; DESCRIPTION: 100mW 270kΩ 75V Thick Film Resistors ±1% ±100ppm/℃ 0603 Chip Resistor - Surface Mount ROHS; MF: FOJAN; MP: FRC0603F2703TS; PACKAGE: 0603; PROD_ID: RES-00824; VALUE: 10k
R19 R25 = SparkFun-Resistors:33KOHM: 33kΩ resistor A resistor is a passive two-terminal electrical component that implements electrical resistance as a circuit element. Resistors act to reduce current flow, and, at the same time, act to lower voltage levels within circuits. - Wikipedia; DESCRIPTION: 330kΩ 100mW 75V Thick Film Resistors ±1% ±100ppm/℃ 0603 Chip Resistor - Surface Mount ROHS; MF: FOJAN; MP: FRC0603F3303TS; PACKAGE: 0603; PROD_ID: RES-08416; VALUE: 33k
R20 R21 = cap_master-smd:R_: RESISTOR; DESCRIPTION: 100mW 75V 10kΩ Thick Film Resistors ±1% ±100ppm/℃ 0603 Chip Resistor - Surface Mount ROHS; MF: FOJAN; MP: FRC0603F1002TS; PACKAGE: 0603
R27-R29 = rcl:R-US_: RESISTOR, American symbol; DESCRIPTION: 62.5mW 100Ω 50V ±5% ±100ppm/℃ Thick Film Resistors 0402 Chip Resistor - Surface Mount ROHS; MF: YAGEO; MP: RC0402JR-07100RL; PACKAGE: 603
R31-R33 = cap_master-smd:R_: RESISTOR; DESCRIPTION: 330Ω 100mW 75V Thick Film Resistors ±5% ±100ppm/℃ 0603 Chip Resistor - Surface Mount ROHS; MF: FOJAN; MP: FRC0603J331 TS; PACKAGE: 0603
R34-R40 R42-R44 R46 R47 = resistor:R-US_: RESISTOR, American symbol; DESCRIPTION: 62.5mW Thick Film Resistors 50V ±100ppm/℃ ±5% 330Ω 0402 Chip Resistor - Surface Mount ROHS; MF: YAGEO; MP: RC0402JR-07330RL; PACKAGE: 0402
T1 T3 = transistor:*-NPN-: NPN Transistror BF959 corrected 2008.03.06; DESCRIPTION: 45V 300mW 250@100mA,1V 500mA NPN SOT-23 Bipolar Transistors - BJT ROHS; MF: Slkor(SLKORMICRO Elec.); MP: BC817-40; PACKAGE: SOT-23
T2 T4 = Smart_lock:SI2301CDS-T1-GE3: MOSFET -20V Vds 8V Vgs SOT-23 Check availability <https://pricing.snapeda.com/parts/SI2301CDS-T1-GE3/Vishay/view-part?ref=eda>; AVAILABILITY: In Stock; DESCRIPTION: P-Channel 20 V 3.1A (Tc) 860mW (Ta), 1.6W (Tc) Surface Mount SOT-23-3 (TO-236); MF: Vishay; MP: SI2301CDS-T1-GE3; PACKAGE: SOT-23-3 Vishay Siliconix; PRICE: None; PURCHASE-URL: https://pricing.snapeda.com/search?q=SI2301CDS-T1-GE3&ref=eda
U1 = Smart_lock:STM32G070CBT6: Check availability <https://pricing.snapeda.com/parts/STM32G030C8T6/STMicroelectronics/view-part?ref=eda> 128KB ARM-MSeries 36KB 64MHz FLASH LQFP-48(7x7) Microcontroller Units (MCUs/MPUs/SOCs) ROHS; DESCRIPTION: 128KB 36KB 64MHz FLASH LQFP-48(7x7) Microcontroller Units (MCUs/MPUs/SOCs) ROHS; MF: STMicroelectronics; MP: STM32G070CBT6; PACKAGE: LQFP-48(7x7)
U2 = Smart_lock:TSM12M: 12 MLF-32 Touch Sensors ROHS; DESCRIPTION: 12 MLF-32 Touch Sensors ROHS; MF: AD Semicon; MP: TSM12M; PACKAGE: MLF-32
U3 = Smart_lock:MFRC52201HN1,151: MFRC52201 Series 1.6 V - 3.6 V IC Smart Card Reader - VQFN-32 Check availability <https://pricing.snapeda.com/parts/MFRC52201HN1%2C151/NXP%20USA/view-part?ref=eda>; DESCRIPTION: HVQFN-32-EP(5x5) RF Chips ROHS; MF: NXP Semicon; MP: MFRC52201HN1,151; PACKAGE: HVQFN-32-EP(5x5)
U4 = Smart_lock:TLV75533PDBVR: AP2112 Series 0.6 A 3.3 V Fixed Output SMT LDO Linear Regulator - SOT23-5 Check availability <https://pricing.snapeda.com/parts/AP2112K-3.3TRG1/Diodes%20Inc./view-part?ref=eda>; DESCRIPTION: 500mA 52dB Fixed 3.3V Positive electrode 5.5V SOT-23-5 Linear Voltage Regulators (LDO) ROHS; MF: Texas Instruments; MP: TLV75533PDBVR; PACKAGE: SOT-23-5
U5 = Smart_lock:TC118S: SOP-8 Motor Driver ICs ROHS Check availability <https://pricing.snapeda.com/parts/TC118S/shenzhen%20fuman%20electronics%20co.%2C%20ltd./view-part?ref=eda>; DESCRIPTION: SOP-8 Motor Driver ICs ROHS; MF: shenzhen fuman electronics; MP: TC118S; PACKAGE: SOP-8
U6 = Smart_lock:AP23341: AP23341-VOICE OTP IC; DESCRIPTION: 8M Bits EPROM 341 Sec Voice Message With 4-Bit ADPCM; MF: APLUS INTEGRATED; MP: AP23341; PACKAGE: SOP8
U7 = Smart_lock:AP4890: IC-4890U 1W AUDIO AMPLIFIER SMD MSOP8 APLUS; DESCRIPTION: 2.7 Watt Audio Power Amplifier; MF: APLUS INTEGRATED; MP: AP4890U-MSOP8; PACKAGE: MSOP8

## Net classes
0 default: clearance 0.205 mm

## Board
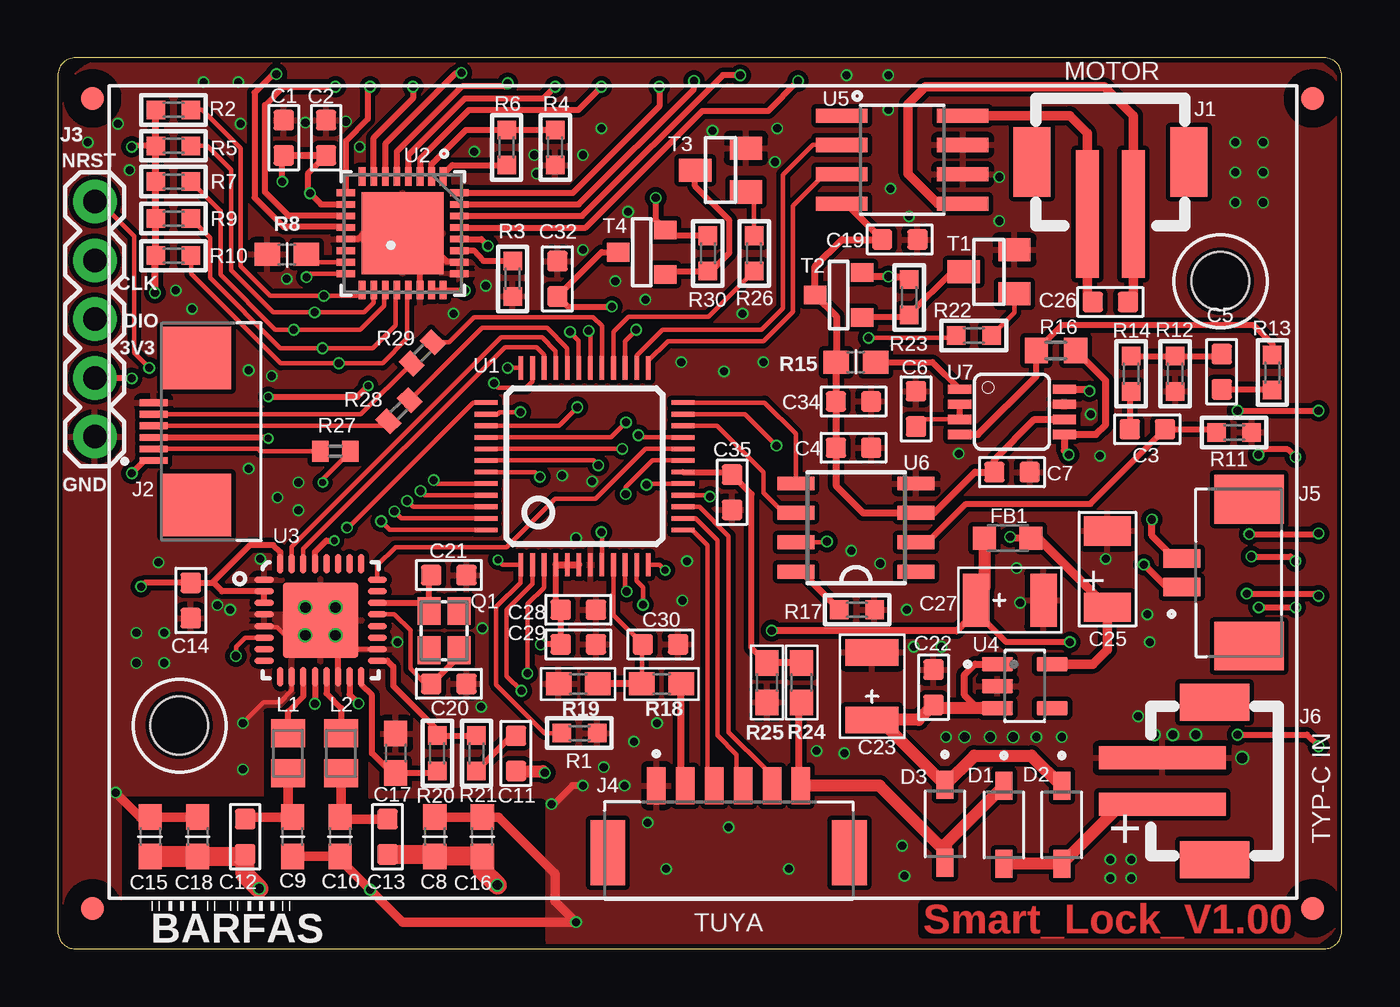
[diagram p6: board, top side]
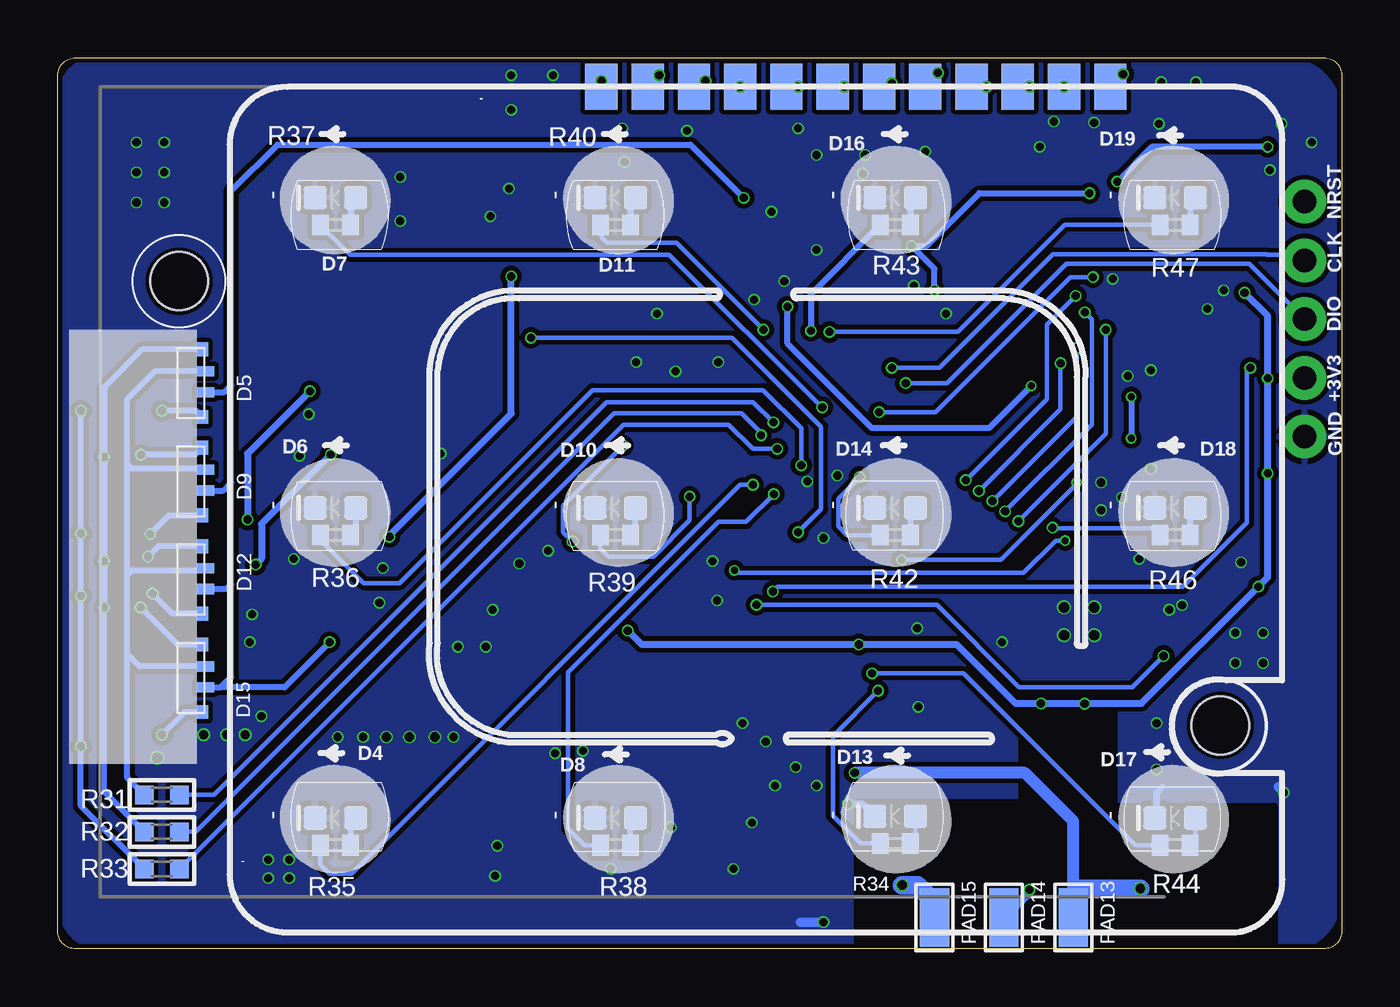
[diagram p7: board, bottom side, seen from below]

Size 55.5 x 38.5 mm. Coordinates in mm from the lower left corner, seen from the top.
Outline: 55.5,0.75 55.5,37.75 arc90 54.75,38.5 0.75,38.5 arc90 0,37.75 0,0.75 arc90 0.75,0 54.75,0 arc90 55.5,0.75
Copper layers (1*16): Top 0.035mm / dielectric 1.6mm / Bottom 0.035mm
Design rules "jlcpcb-2layers *": minimum track width 5mil, minimum drill 0.3mm, track to track 5mil, track to pad 5mil, pad to pad 5mil, via to via 5mil, smd to smd 5mil, copper to edge 0.2mm, drill to drill 6mil, minimum pad ring 10mil, minimum via ring 3mil, stop-mask expansion 4mil, vias tented up to drill 20mil, thermal gap 10mil
Holes 2.5 mm at 50.25,28.85 5.25,9.65

### Footprints (pad centres in the part's own frame; a part is rotated, then mirrored left to right if it is on the bottom)
C0603 = smd 0.889 x 0.889: 1 0,0.762; 2 0,-0.762
C0603' = smd 1.1 x 1: 1 -0.85,0; 2 0.85,0
AVX-B = smd 1.143 x 2.286: + -1.46,0; - 1.46,0
CT1206 = smd 1.27 x 2.032: + -1.651,0; - 1.651,0
SOD3715X145N = smd 1.21 x 0.73: A 1.68,0; C -1.68,0
LED-0603 = smd 1 x 1: A -0.877,0; C 0.877,0
SMD-4P,1X3MM = smd 0.44 x 0.75: + 0.45,0.375; G- -0.45,0.375 | smd 0.6 x 0.5: B- -1.4,0.25; R- 1.52,0.25
FIDUCIAL_1MM = smd 1 x 1: 1 0,0
L2012C = smd 1 x 1: 1 -1,0; 2 1,0
B2B-PH-SM4-TB(LF)(SN) = smd 1 x 5.5: 1 -1,0; 2 1,0 | smd 1.6 x 3: 3 3.4,2.25; 4 -3.4,2.25
WE_68710614522 = smd 0.29 x 1.2: 1 -1.25,1.86; 2 -0.75,1.86; 3 -0.25,1.86; 4 0.25,1.86; 5 0.75,1.86; 6 1.25,1.86 | smd 2.7 x 3: S1 -3.18,0; S2 3.18,0
1X05 = drill 1.016 pad 1.88: 1 0,0; 2 2.54,0; 3 5.08,0; 4 7.62,0; 5 10.16,0
1X6PIN_1.25MM = smd 0.8 x 1.6: 1 -3.125,2.8; 2 -1.875,2.8; 3 -0.625,2.8; 4 0.625,2.8; 5 1.875,2.8; 6 3.125,2.8 | smd 1.5 x 2.8: S1 -5.225,-0.1; S2 5.225,-0.1
AMPHENOL_10114828-10102LF = smd 0.8 x 1.6: 1 -0.625,2.9; 2 0.625,2.9 | smd 2.1 x 3: S1 -3.175,0; S2 3.175,0
INDC2012X105N = smd 1.2 x 1.47: 1 -0.86,0; 2 0.86,0
SMD1,27-2,54 = smd 1.4 x 2: 1 0,0
5-1,8 = smd 1.27 x 2.54: 1 0,0
2.5X2.0_KX-6 = smd 1.2 x 1: 1 -0.85,-0.65; 2 0.85,-0.65; 3 0.85,0.65; 4 -0.85,0.65
R0603 = smd 0.8 x 0.8: 1 -0.762,0; 2 0.762,0
0603 = smd 1.1 x 1: 1 -0.85,0; 2 0.85,0
R0603' = smd 1 x 1.1: 1 -0.85,0; 2 0.85,0
R0402 = smd 0.7 x 0.9: 1 -0.65,0; 2 0.65,0
SOT23-BEC = smd 1 x 1.4: B -0.95,-1.1; C 0,1.1; E 0.95,-1.1
SOT-23 = smd 0.972 x 0.802: 1 -1.016,0.965; 2 -1.016,-0.965; 3 1.016,0
LQFP48 = smd 0.2 x 1: 1 -2.75,-4.25; 2 -2.25,-4.25; 3 -1.75,-4.25; 4 -1.25,-4.25; 5 -0.75,-4.25; 6 -0.25,-4.25; 7 0.25,-4.25; 8 0.75,-4.25; 9 1.25,-4.25; 10 1.75,-4.25; 11 2.25,-4.25; 12 2.75,-4.25; 25 2.75,4.25; 26 2.25,4.25; 27 1.75,4.25; 28 1.25,4.25; 29 0.75,4.25; 30 0.25,4.25; 31 -0.25,4.25; 32 -0.75,4.25; 33 -1.25,4.25; 34 -1.75,4.25; 35 -2.25,4.25; 36 -2.75,4.25 | smd 1 x 0.2: 13 4.25,-2.75; 14 4.25,-2.25; 15 4.25,-1.75; 16 4.25,-1.25; 17 4.25,-0.75; 18 4.25,-0.25; 19 4.25,0.25; 20 4.25,0.75; 21 4.25,1.25; 22 4.25,1.75; 23 4.25,2.25; 24 4.25,2.75; 37 -4.25,2.75; 38 -4.25,2.25; 39 -4.25,1.75; 40 -4.25,1.25; 41 -4.25,0.75; 42 -4.25,0.25; 43 -4.25,-0.25; 44 -4.25,-0.75; 45 -4.25,-1.25; 46 -4.25,-1.75; 47 -4.25,-2.25; 48 -4.25,-2.75
QFN_32_UH = smd 0.805 x 0.29: 1 -2.452,1.75; 2 -2.452,1.25; 3 -2.452,0.75; 4 -2.452,0.25; 5 -2.452,-0.25; 6 -2.452,-0.75; 7 -2.452,-1.25; 8 -2.452,-1.75; 17 2.452,-1.75; 18 2.452,-1.25; 19 2.452,-0.75; 20 2.452,-0.25; 21 2.452,0.25; 22 2.452,0.75; 23 2.452,1.25; 24 2.452,1.75 | smd 0.29 x 0.805: 9 -1.75,-2.452; 10 -1.25,-2.452; 11 -0.75,-2.452; 12 -0.25,-2.452; 13 0.25,-2.452; 14 0.75,-2.452; 15 1.25,-2.452; 16 1.75,-2.452; 25 1.75,2.452; 26 1.25,2.452; 27 0.75,2.452; 28 0.25,2.452; 29 -0.25,2.452; 30 -0.75,2.452; 31 -1.25,2.452; 32 -1.75,2.452 | smd 3.55 x 3.55: 33 0,0
QFN50P500X500X100-33N = smd 0.85 x 0.29: 1 -2.45,1.75; 2 -2.45,1.25; 3 -2.45,0.75; 4 -2.45,0.25; 5 -2.45,-0.25; 6 -2.45,-0.75; 7 -2.45,-1.25; 8 -2.45,-1.75; 17 2.45,-1.75; 18 2.45,-1.25; 19 2.45,-0.75; 20 2.45,-0.25; 21 2.45,0.25; 22 2.45,0.75; 23 2.45,1.25; 24 2.45,1.75 | smd 0.29 x 0.85: 9 -1.75,-2.45; 10 -1.25,-2.45; 11 -0.75,-2.45; 12 -0.25,-2.45; 13 0.25,-2.45; 14 0.75,-2.45; 15 1.25,-2.45; 16 1.75,-2.45; 25 1.75,2.45; 26 1.25,2.45; 27 0.75,2.45; 28 0.25,2.45; 29 -0.25,2.45; 30 -0.75,2.45; 31 -1.25,2.45; 32 -1.75,2.45 | smd 3.25 x 3.25: 33 0,0
SOT95P285X140-5N = smd 1.35 x 0.6: 1 -1.185,0.95; 2 -1.185,0; 3 -1.185,-0.95; 4 1.185,-0.95; 5 1.185,0.95
SO08 = smd 0.61 x 2.21: 1 -1.905,-2.616; 2 -0.635,-2.616; 3 0.635,-2.616; 4 1.905,-2.616; 5 1.905,2.616; 6 0.635,2.616; 7 -0.635,2.616; 8 -1.905,2.616
SOP8 = smd 0.6 x 1.6: 1 -1.905,-2.6; 2 -0.635,-2.6; 3 0.635,-2.6; 4 1.905,-2.6; 5 1.905,2.6; 6 0.635,2.6; 7 -0.635,2.6; 8 -1.905,2.6
MSOP08 = smd 0.4 x 1: 1 -0.976,-2.263; 2 -0.326,-2.263; 3 0.324,-2.263; 4 0.974,-2.263; 5 0.974,2.262; 6 0.324,2.262; 7 -0.326,2.262; 8 -0.976,2.262

### Placement (x,y rotation side)
C1  9.77,35.05 180 top
C2  11.6,35.05 180 top
C3  47.1,22.45 90 top
C4  34.4,21.65 90 top
C5  50.31,24.94 0 top
C6  37.1,23.33 0 top
C7  41.25,20.6 270 top
C8  10pF  [C0603']  16.3,4.84 90 top
C9  47pF  [C0603']  10.15,4.84 90 top
C10  47pF  [C0603']  12.2,4.84 270 top
C11  19.8,8.44 0 top
C12  8.1,4.84 0 top
C13  14.25,4.84 0 top
C14  5.75,15.05 180 top
C15  180pF  [C0603']  4,4.84 270 top
C16  180pF  [C0603']  18.35,4.84 90 top
C17  10pF  [C0603']  14.6,8.45 270 top
C18  10pF  [C0603']  6.05,4.84 270 top
C19  36.4,30.65 90 top
C20  16.9,11.45 90 top
C21  16.9,16.15 90 top
C22  37.86,11.3 180 top
C23  35.2,11.35 90 top
C25  45.38,16.41 90 top
C26  45.5,27.95 90 top
C27  41.15,15.07 0 top
C28  22.5,14.65 90 top
C29  22.5,13.15 90 top
C30  26.05,13.15 90 top
C32  21.6,28.95 180 top
C34  34.4,23.65 90 top
C35  29.15,19.73 0 top
D1  40.9,5.36 270 top
D2  43.4,5.36 270 top
D3  38.35,5.4 270 top
D4  43.5,5.65 180 bottom
D5  49.5,24.5 270 bottom
D6  43.5,19.05 180 bottom
D7  43.5,32.45 180 bottom
D8  31.4,5.65 180 bottom
D9  49.5,20.25 270 bottom
D10  31.4,19.05 180 bottom
D11  31.4,32.45 180 bottom
D12  49.5,16 270 bottom
D13  19.3,5.73 180 bottom
D14  19.3,19.05 180 bottom
D15  49.5,11.75 270 bottom
D16  19.3,32.45 180 bottom
D17  7.2,5.65 180 bottom
D18  7.2,19.05 180 bottom
D19  7.2,32.45 180 bottom
F1  1.5,1.75 0 top
F2  54.25,36.75 0 top
F3  1.5,36.75 0 top
F4  54.25,1.75 0 top
FB1  41.06,17.74 180 top
J1  45.5,31.75 0 top
J2  6,22.35 90 top
J3  1.6,22.13 90 top
J4  29,4.25 0 top
J5  51.5,16.25 90 top
J6  47.75,7.25 270 top
L1  9.95,8.45 270 top
L2  12.25,8.45 270 top
PAD1  32,37.25 180 bottom
PAD2  30,37.25 180 bottom
PAD3  28,37.25 180 bottom
PAD4  26,37.25 180 bottom
PAD5  24,37.25 180 bottom
PAD6  22,37.25 180 bottom
PAD7  18,37.25 180 bottom
PAD8  16,37.25 180 bottom
PAD9  14,37.25 180 bottom
PAD10  12,37.25 180 bottom
PAD11  10,37.25 180 bottom
PAD12  20,37.25 180 bottom
PAD13  11.6,1.35 180 bottom
PAD14  14.6,1.35 180 bottom
PAD15  17.6,1.35 180 bottom
Q1  16.7,13.75 270 top
R1  22.55,9.32 0 top
R2  5,36.25 0 top
R3  19.66,28.95 270 top
R4  21.5,34.63 90 top
R5  5,34.7 0 top
R6  19.4,34.63 90 top
R7  5,33.15 0 top
R8  9.9,30.01 180 top
R9  5,31.55 0 top
R10  5,29.95 0 top
R11  50.85,22.31 0 top
R12  48.3,24.85 270 top
R13  52.5,24.9 90 top
R14  46.4,24.85 90 top
R15  34.5,25.35 180 top
R16  33K  [R0603']  43.15,25.85 180 top
R17  34.55,14.65 0 top
R18  26.1,11.45 180 top
R19  22.5,11.45 180 top
R20  16.4,8.45 90 top
R21  18.1,8.45 270 top
R22  39.6,26.5 0 top
R23  36.8,28.15 270 top
R24  32.15,11.5 90 top
R25  30.65,11.5 270 top
R26  30.1,30.05 90 top
R27  12,21.5 0 top
R28  14.75,23.25 45 top
R29  15.75,25.75 45 top
R30  28.1,30.05 270 top
R31  51,6.65 0 bottom
R32  51,5.05 0 bottom
R33  51,3.45 0 bottom
R34  19.3,4.55 180 bottom
R35  43.5,4.48 180 bottom
R36  43.5,17.88 180 bottom
R37  43.5,31.28 180 bottom
R38  31.4,4.48 180 bottom
R39  31.4,17.88 180 bottom
R40  31.4,31.28 180 bottom
R42  19.3,17.88 180 bottom
R43  19.3,31.28 180 bottom
R44  7.2,4.48 180 bottom
R46  7.2,17.88 180 bottom
R47  7.2,31.28 180 bottom
T1  40.25,29.25 90 top
T2  33.75,28.25 180 top
T3  28.65,33.65 90 top
T4  25.25,30.1 180 top
U1  22.77,20.85 0 top
U2  14.91,30.92 270 top
U3  11.36,14.2 0 top
U4  41.8,11.35 0 top
U5  36.5,34.1 270 top
U6  34.5,18.2 90 top
U7  41.25,23.2 270 top

### Tracks (layer width: path | path; a pad name or v marks a point on that pad's centre or on a via)
+3V3  (via drill 0.35)
  Top 0.254: v43.75,13.25 41.01,13.25 39.69,14.57 | C27.+ 39.5,15.07 | U1.4 21.52,14.87 C28.1 C29.1 v20.87,13.15 | C2.1 10.8,33.49 10.8,32.75 v10.9,32.65 11.38,32.17 U2.10 | U2.28 18.3,30.67 v18.59,30.37 | U2.23 U2.24 17.58,28.47 v17.6,28.45 | R5.1 3.25,34.7 v3.2,34.65 | v9.7,33.15 9.7,34.22 C1.1 | U3.3 U3.2 7.1,15.45 6.73,15.81 6.66,15.81 | 6.66,15.81 C14.2 3.76,15.81 v3.6,15.65 | U3.32 9.61,17.15 9.31,17.45 8.3,17.45 6.66,15.81 | U3.12 v11.11,10.59 | U3.15 12.61,10.99 v13,10.6 | J2.1 3.75,21.1 v3.2,20.55 | J3.2 3.18,24.67 v3.2,24.65 | R30.1 26.52,30.81 T4.2 25.85,31.48 v25.85,32.45
  Top 0.305: U1.4 U1.5 U1.6 | v30.86,13.75 30.87,13.74 38.86,13.74 39.69,14.57 C27.+ | v4.2,28.35 4.2,29.91 R10.1 R9.1 R7.1 R5.1 R2.1 | C1.1 | C1.1 C2.1
  Top 0.406: 39.5,15.07 39.5,14.25
  Top 0.508: FB1.2 40.06,15.63 39.5,15.07
  Bottom 0.254: v43.75,13.25 45.7,11.3 48.45,11.3 | 48.45,11.3 48,11.75 48,15.75 | 48,15.75 48,20.15 | 48,15.75 48.2,15.55 D12.+ | 48,20.15 48.35,19.8 D9.+ | 48,20.15 48,24.35 | 48,24.35 48,32.75 46,34.75 28.15,34.75 v25.85,32.45 | v17.6,28.45 17.6,29.38 v18.59,30.37 17.94,30.37 15.66,32.65 v10.9,32.65 | v3.2,34.65 8.2,34.65 v9.7,33.15 | v11.11,10.59 v11.1,10.6 | D15.+ 48.45,11.3 | D5.+ 48.3,24.05 48,24.35
  Bottom 0.305: v30.86,13.75 30.26,13.15 v20.87,13.15 16.65,13.15 14.1,10.6 v13,10.6 v11.1,10.6 8.65,10.6 v3.6,15.65 3.2,16.05 v3.2,20.55 v3.2,24.65 3.2,27.35 v4.2,28.35
ANT  (via drill 0.35, 0.4)
  Top 0.508: v21.05,7.6 20.97,7.68 C11.2
  Top 0.8: v8.7,2.6 8.2,3.1
  Top 0.813: 8.2,3.1 8.1,3.2 C12.2 8.01,3.99 C18.2
  Top 0.9: C15.2 C18.2
  Bottom 0.508: v21.05,7.6 13.7,7.6 11.6,5.5 PAD13.1
  Bottom 0.8: PAD13.1 11.6,2.25 11.25,2.6 v8.7,2.6
ANT2  (via drill 0.4)
  Top 0.8: C16.1 18.35,3.4 v19,2.75
  Top 0.813: C16.1 C8.1 16.21,4.08 C13.2
  Bottom 0.8: PAD15.1 17.6,2 18.35,2.75 v19,2.75
BAT_FEEDBACK
  Top 0.254: U1.18 29.04,20.6 C35.1 30,19.65 30,13 R25.1
  Top 0.305: R24.2 R25.1
BLUE  (via drill 0.35)
  Top 0.203: v25.1,22.19 25.19,22.1 U1.21
  Bottom 0.203: v25.1,22.19 25.1,22.29 25.95,23.14 31.45,23.14 49.54,5.05 R32.2
BUTTON_RST
  Top 0.305: J4.2 26.95,7.22 R18.1
CON_POWER
  Top 0.305: J4.6 32.02,7.15 32.02,10.53 R24.1
  Top 0.508: D1.C 38.39,4.53 38.39,3.68 D3.A 38.35,4.22 35.52,7.05 J4.6
FINGER_EN
  Top 0.203: U1.28 24.02,26.66 24.68,27.32 28.13,27.32 R26.1
FINGER_OUT  (via drill 0.3)
  Top 0.203: U1.1 20,16.6 | 20,16.6 19.23,16.6 v19.03,16.81 | v11.45,20.15 11.45,20.3 R27.2 | 20,16.6 20,15.83 18.95,14.78 18.95,11.42 21.05,9.32 R1.1
  Bottom 0.203: v19.03,16.81 14.74,16.81 11.45,20.1 v11.45,20.15
FINGER_RX
  Top 0.203: U1.29 23.52,26.92 23.15,27.29 17.99,27.29 16.91,26.21 R29.2
FINGER_TX
  Top 0.203: U1.32 22.02,25.96 21.14,26.83 18.33,26.83 R28.2
FİNGER_VCC  (via drill 0.3, 0.35)
  Top 0.254: v13.42,24.33 12.94,23.85 v9.1,23.85 | J2.3 9.06,22.1 v9.1,22.06 | v23.95,27.75 22.05,27.75 C32.1 23.51,30.1 T4.3
  Bottom 0.254: v9.1,23.85 v9.1,22.06 | v13.42,24.33 15.25,22.5 20.3,22.5 23.95,26.15 v23.95,27.75
GND  (via drill 0.35, 0.4, 0.45)
  Top 0.203: v8,9.75 8.9,10.65 9.6,10.65 10.11,11.16 U3.10 10.16,11.79 | 12.11,13.44 12.11,12.85 12.21,12.95 U3.18 | U3.33 11.26,14.2 v10.71,14.75 v10.7,14.75 | U3.5 8.96,13.9 9.48,13.9 9.83,13.55 v10.7,13.55
  Top 0.254: U2.13 12.48,30.69 12.99,30.69 13.22,30.92 U2.33 15.66,30.17 | U2.22 15.66,30.17 | U2.26 17.34,29.69 16.82,29.69 16.34,30.17 15.66,30.17 | U3.14 12.11,13.44 v12,13.55
  Top 0.305: v22.7,7.05 22.24,7.05 21.44,6.25 v21.34,6.25
  Top 0.406: C9.1 C10.2 12.2,3.84 v13.49,2.55 v13.5,2.55 14.9,1.15 v22.4,1.15 21.5,2.05 21.5,3.25 19.06,5.69 C16.2 C8.2 | C18.1 C15.1 3.56,5.69 v2.5,6.75
  Bottom 0.305: D17.C 8,5.73 8,6.75 7.75,7 | D13.C 20.7,6.25 v21.34,6.25
  Bottom 0.406: PAD14.1 13.5,2.45 v13.5,2.55 | v22.4,1.15 23.4,1.15 | v2.5,6.75 2.75,7
  other vias: 9.5,19.5 8.25,20.75 8.25,25 9.25,24.75 35.55,16.65 34.3,17.2 8,7.75 24.5,7.05 23.6,7.85 34,8.45 32.8,8.55 38.4,9.15 36.7,14.65 41.6,14.95 41.45,16.45 47.1,14.45 45.3,16.85 7.45,14.65 6.3,37.45 47.4,9.25 6.9,14.85 2.6,35.65 1.3,34.85 7.8,37.45 7.9,35.65 3.1,33.65 9.9,28.95 18.5,28.65 5.8,27.65 4.35,16.7 49.2,9.25 48.2,9.25 8.75,16.85 51.2,8.25 10.7,35.7 12.45,35.75 5.1,28.45 22.7,34.3 20.6,34.3 18,34.45 22.7,30.2 20.7,33.5 23.5,35.45 40.7,33.35 36,32.85 36.8,31.65 35.9,37.75 34.1,37.75 35.9,36.25 30.5,25.35 28.8,24.95 29.6,27.45 31.1,35.45 31,34 26.95,25.35 23.1,20.2 21.8,20.45 22.4,17.75 24.65,31.85 28.3,35.35 29,5.25 31.6,3.45 26.3,3.45 25.5,5.45 46.4,3.05 45.5,3.05 45.5,3.85 46.4,3.85 36.5,4.45 36.6,3.15 18.35,13.85 18.3,10.45 38.95,21.4 44.65,23.1 45.05,21.3 12,14.75 27.2,16.75 27,15.05 25.9,9.75 24.9,8.95 37,13.05 38.2,13.05 52.1,32.25 50.9,32.25 52.1,33.55 50.9,33.55 52.1,34.85 50.9,34.85 46.7,10.05 43.4,9.15 47.2,13.25 42.3,9.15 25.4,28.05 24.1,28.85 4.6,12.35 3.4,12.35 4.6,13.65 3.4,13.65 10.4,20.15 10.4,18.95 39.2,9.15 41.3,9.15 40.3,9.15 13.05,34.65 17.1,27.45 40.7,31.45 14.68,13.25
  pour Bottom (isolate 0.2): 55.51,36.78 55.51,1.98 arc-90 53.48,-0.05 2.31,-0.05 arc-90 0.04,2.22 0.04,36.12 arc-90 2.41,38.49 53.79,38.49 arc-90
  pour Top (isolate 0.2): 55.51,36.78 55.51,1.98 arc-90 53.48,-0.05 2.31,-0.05 arc-90 0.04,2.22 0.04,36.12 arc-90 2.41,38.49 53.79,38.49 arc-90
GREEN  (via drill 0.35)
  Top 0.203: v24.56,22.75 23.91,22.1 U1.40
  Bottom 0.203: v24.56,22.75 25.44,23.62 31.77,23.62 48.75,6.65 R31.2
LED1  (via drill 0.35)
  Top 0.203: U1.17 25.5,20.1 v25.45,20.05
  Bottom 0.203: v25.45,20.05 26,20.05 42.8,3.25 43.75,3.25 44.15,3.65 R35.2
LED2  (via drill 0.35)
  Top 0.203: U1.42 23.15,21.1 v23.36,20.89
  Bottom 0.203: v23.36,20.89 23.36,22.49 25.01,24.14 32.38,24.14 40.72,15.8 42.28,15.8 44.15,17.67 R36.2
LED3  (via drill 0.35)
  Top 0.203: v22.46,23.4 21.66,22.6 U1.39
  Bottom 0.203: v22.46,23.4 22.48,23.4 29.08,30 42.87,30 R37.2
LED4  (via drill 0.35)
  Top 0.203: U1.19 25.7,21.1 24.55,19.95 v24.55,19.65
  Bottom 0.203: v24.55,19.65 25.75,18.45 26.95,18.45 33.44,11.96 33.44,5.19 32.73,4.48 R38.2
LED5  (via drill 0.35)
  Top 0.203: U1.16 28.12,19.6 v28.19,19.54
  Bottom 0.203: R39.2 32.05,17.3 31.7,16.95 29.75,16.95 28.19,18.51 v28.19,19.54
LED6  (via drill 0.35)
  Top 0.203: v25,26.75 25,26.74 24.52,26.26 U1.27
  Bottom 0.203: R40.2 32,31.23 32,30.75 31.75,30.5 28.75,30.5 v25,26.75
LED7  (via drill 0.35)
  Top 0.203: U1.43 20.63,20.6 v20.84,20.39
  Bottom 0.203: R42.2 21.38,17.88 21.75,18.25 21.75,19.45 20.84,20.36 v20.84,20.39
LED8  (via drill 0.35)
  Top 0.203: U1.2 20.52,15.77 19.41,14.66 19.41,11.78 v20.04,11.15
  Bottom 0.203: v20.04,11.15 22,9.19 22,5.75 20.8,4.55 R34.2
LED9  (via drill 0.35)
  Top 0.203: v22.95,26.7 23.02,26.63 U1.30
  Bottom 0.254: R43.2 22.95,28.28 v22.95,26.7
LED10  (via drill 0.35)
  Top 0.203: U1.3 21.02,15.61 20.32,14.9 20.32,11.91 v20.3,11.9
  Bottom 0.203: R44.2 8.93,4.48 16.35,11.9 v20.3,11.9
LED11  (via drill 0.35 pad 0.45)
  Top 0.203: U1.37 17.95,23.6 12.55,18.2 v12.5,18.2
  Bottom 0.203: v12.5,18.2 12.48,18.18 8.15,18.18 R46.2
LED12  (via drill 0.35)
  Top 0.203: U1.31 22.52,26.28 v22.14,26.66
  Bottom 0.203: v22.14,26.66 16.59,26.66 11.97,31.28 R47.2
M_CCW
  Top 0.203: U1.25 25.52,25.4 26.37,26.25 30.5,26.25 31.78,27.53 31.78,32.11 33.13,33.47 U5.3
M_CW
  Top 0.203: U1.26 25.01,25.62 26.14,26.75 30.42,26.75 31.35,27.68 31.35,33.45 32.63,34.73 U5.2
MOTOR_EN  (via drill 0.35)
  Top 0.203: U1.8 23.52,17.98 v23.5,18 | v35.05,26.4 38.74,26.4 R22.1
  Bottom 0.203: v23.5,18 22.5,19 22.5,22.55 26.35,26.4 v35.05,26.4
MOTOR_SOUND_VCC
  Top 0.305: U7.6 42.23,22.88 40.49,21.14 C7.2 39.65,20.6 37.88,18.84 U6.3 34.81,18.84 33.64,20.01 C4.1 C34.1 33.64,25.34 R15.2 33.65,27.33 T2.3 32.73,29.48 33.9,30.65 C19.1 34.09,32.2 U5.4
N$1
  Top 0.305: R17.1 32.14,16.3 U6.8
N$2
  Top 0.254: R15.1 37.81,25.35 U7.1
N$3
  Bottom 0.203: 18.65,5.5 D13.A 18.42,4.78 R34.1
N$4
  Bottom 0.254: 52.5,12.75 52.5,16.15 | 52.5,16.15 52.5,20.95 | 52.5,20.95 52.5,23.75 51.3,24.95 D5.G- | 52.5,20.95 52.3,20.75 49.6,20.75 49.17,20.75 D9.G- | 52.5,16.15 52.28,16.37 49.21,16.37 D12.G- | 52.5,12.75 52.5,7.39 R31.1 | D15.G- 51.95,12.2 52.5,12.75
N$5  (via drill 0.35)
  Top 0.254: v53.5,21.25 53.17,21.58 52.13,21.58 v51.9,21.35 | v51.6,16.95 53.3,16.95 v53.5,16.75 | v51.92,14.75 v53.5,14.75
  Bottom 0.254: 51.96,21.41 v51.9,21.35 49.55,21.35 D9.B- | v51.6,16.95 51.15,17.4 D12.B- | v51.92,14.75 50.32,13.15 D15.B- | R32.1 53.5,6.79 v53.5,14.75 v53.5,16.75 v53.5,21.25 53.5,24.25 51.85,25.9 D5.B-
N$6
  Top 0.305: U4.3 40.57,10.44 39.72,10.44 39.2,10.96 39.2,11.85 39.65,12.3 U4.1
  Top 0.508: D2.C 42.09,8.35 39.62,8.35 D3.C 35.54,9.89 C23.+ 37.21,9.89 C22.1 38.01,10.39 40.6,10.39 U4.3
N$7
  Bottom 0.254: D4.A 42.85,5.42 R35.1
N$8
  Bottom 0.254: D6.A 42.62,18.11 R36.1
N$9
  Top 0.406: U5.8 43.74,36.01 44.5,35.25 J1.1 44.5,28.19 C26.1
N$10  (via drill 0.35)
  Top 0.254: v51,23.25 v54.5,23.25 | v51.5,17.92 54.47,17.92 v54.5,17.95 | v51.4,15.35 54.4,15.35 v54.5,15.25 | v51,9.25 54,9.25 v54.5,8.75
  Bottom 0.254: v54.5,23.25 v54.5,17.95 v54.5,15.25 v54.5,8.75 54.5,6.19 R33.1 | v51,23.25 49.52,23.25 D5.R- | v51.5,17.92 50.69,18.73 D9.R- | v51.4,15.35 50.53,14.48 D12.R- | v51,9.25 50.02,10.23 D15.R-
N$11
  Bottom 0.305: D7.A 42.85,32.22 R37.1
N$12
  Bottom 0.203: R38.1
  Bottom 0.254: D8.A 30.76,5.41 R38.1
N$13
  Bottom 0.254: R39.1 30.52,18.11 D10.A
N$14
  Bottom 0.305: D11.A 30.75,32.22 R40.1
N$15
  Bottom 0.254: D14.A 18.65,18.82 R42.1
N$16  (via drill 0.35)
  Top 0.254: U2.31 22.52,32.17 27.5,37.15 v27.5,37.5
  Bottom 0.254: PAD3.1 27.75,37.25 v27.5,37.5
N$17
  Bottom 0.305: D16.A 18.65,32.22 R43.1
N$18
  Bottom 0.203: R44.1 6.32,4.71 D17.A
N$19
  Bottom 0.254: R46.1 6.55,18.82 D18.A
N$20
  Bottom 0.254: D19.A 6.55,32.22 R47.1
N$21
  Top 0.203: R26.2 30.1,32.35 T3.B
N$23
  Top 0.203: U7.3 37.41,22.88 C6.2
  Top 0.254: U7.3 U7.2
N$24
  Top 0.406: U5.5 38.05,32.2 36.75,33.5 36.75,36.5 37.5,37.25 45.25,37.25 46.5,36 J1.2 | 46.26,31.51 J1.2 | J1.2 46.5,28.19 C26.2
N$25
  Top 0.254: C5.2 52.46,24.18 R13.1
N$26
  Top 0.254: R3.1 18.41,29.71 17.99,30.17 U2.27
N$27
  Top 0.254: R13.2 52.5,26.15 51.7,26.95 43.4,26.95 R16.2 42.3,24.75
  Top 0.305: U7.4 39.78,22.23 42.3,24.75
N$28
  Top 0.254: T4.1 26.42,29.29 R30.2 28.25,29.29 29.03,30.07 29.03,31.47 27.55,32.96 T3.C
N$29
  Top 0.254: R14.1 46.34,24.03 C3.1
N$30  (via drill 0.35)
  Top 0.254: PAD4.1 26,36.4 22.27,32.67 U2.32
  other vias: 26,37.25
N$31  (via drill 0.35)
  Top 0.254: U2.3 15.68,33.39 15.68,34.16 17.77,36.25 22.5,36.25 v23.5,37.25
  Bottom 0.254: PAD5.1 v23.5,37.25
N$32  (via drill 0.35)
  Top 0.254: U2.4 15.16,34.31 17.6,36.75 21,36.75 v21.5,37.25
  Bottom 0.254: PAD6.1 v21.5,37.25
N$33  (via drill 0.35)
  Top 0.254: U2.30 22.67,31.67 28.75,37.75 v29.5,37.75
  Bottom 0.254: PAD2.1 v29.5,37.75
N$34  (via drill 0.35)
  Top 0.254: v32,37.5 30.7,36.2 27.85,36.2 22.82,31.17 U2.29
  Bottom 0.254: PAD1.1 v32,37.5
N$35  (via drill 0.35)
  Top 0.254: U2.6 14.18,33.39 14.18,34.81 17.22,37.85 v17.45,37.85
  Bottom 0.254: PAD7.1 17.45,37.8 v17.45,37.85
N$36  (via drill 0.35)
  Top 0.254: U2.9 12.46,34.91 13.4,35.85 13.4,37.15 v13.5,37.25
  Bottom 0.254: PAD9.1 v13.5,37.25
N$37  (via drill 0.35)
  Top 0.254: U2.11 9.99,31.67 8.96,32.7 8.96,36.46 9.75,37.25 PAD10.1
  other vias: 12,37.25
N$38
  Top 0.254: R6.1 17.05,33.87 16.66,33.47 U2.1
N$39  (via drill 0.35)
  Top 0.254: v9.45,37.8 9.3,37.8 8.5,37 8.5,32.46 9.77,31.19 12.43,31.19 U2.12
  Bottom 0.254: PAD11.1 v9.45,37.8
N$40
  Top 0.254: U2.2 16.16,33.91 17.64,35.39 R6.2 21.42,35.39 21.46,35.35 R4.2
N$41  (via drill 0.35)
  Top 0.254: U2.5 14.66,34.46 17.47,37.27 19.32,37.27 v19.45,37.4
  Bottom 0.254: PAD12.1 19.85,37.4 v19.45,37.4
N$42
  Top 0.203: U2.15 11.28,29.67 10.9,30.05 R8.1
N$43  (via drill 0.35)
  Top 0.254: U2.7 13.66,35.06 15.35,36.75 v15.35,37.25
  Bottom 0.254: PAD8.1 v15.35,37.25
N$44
  Top 0.203: R22.2 41.35,27.49 T1.B
N$45
  Top 0.254: R14.2 R12.1 50.22,25.61 C5.1
N$46
  cutout Bottom: 20.96,0.27 20.96,6.35 13.86,6.35 13.86,10.61 9.82,10.61 9.82,6.18 2.9,6.18 2.9,0.27
N$47
  cutout Top: 20.96,0.27 20.96,6.35 13.31,6.35 13.31,10.26 9.02,10.26 9.02,6.43 2.9,6.43 2.9,0.27
N$48
  Top 0.254: T2.1 36.7,27.29 R23.2 38.66,29.25 T1.C
N$53
  Top 0.203: R27.1 8.75,21.5 8.65,21.6 J2.2
N$54
  Top 0.203: R28.1 14.27,22.79 14.08,22.6 J2.4
N$55
  Top 0.254: R21.2 19.62,9.2 C11.1
N$56
  Top 0.406: L1.2 9.95,5.89 C9.2 8.19,5.69 C12.1
N$57
  Top 0.406: L2.2 12.25,5.74 C10.1 12.29,5.6 C13.1
N$58
  Top 0.203: J2.5 13.1,23.1 R29.1
NRST  (via drill 0.35, 0.35 pad 0.45)
  Top 0.203: U1.10 24.52,15.51 v24.59,15.44 | v3.95,25.1 3.3,25.75 3.3,30.8 1.81,32.29 J3.5
  Bottom 0.203: v24.59,15.44 24.39,15.64 6.86,15.64 4.1,18.4 4.1,24.95 v3.95,25.1
OC1
  Top 0.2: U3.21 14.53,14.45 15.24,13.76 15.24,12.09 | 16.24,11.55 16.05,11.45
  Top 0.203: C20.1 15.88,11.45 15.24,12.09
  Top 0.254: 15.88,11.45 16.05,11.45 | 16.24,11.55 16.27,11.55 17.35,12.63 Q1.3
OC2
  Top 0.254: C21.1 16.05,16.06 Q1.1 15.7,14.95 U3.22
RED  (via drill 0.35)
  Top 0.203: v24.4,21.6 U1.41
  Bottom 0.203: v24.4,21.6 25.45,21.6 26.5,22.65 31,22.65 31.04,22.65 R33.2
RFID_MISO
  Top 0.203: U1.33 21.52,25.83 20.93,26.43 19.16,26.43 10.11,17.37 U3.31
RFID_MOSI
  Top 0.203: U3.30 10.61,17.29 19.33,26 20.7,26 21.02,25.68 U1.34
RFID_RST  (via drill 0.35)
  Top 0.203: U1.11 25.02,15.89 25.3,15.62 v25.3,14.87 | U3.6 8.1,13.45 7.7,13.04 v7.7,12.65
  Bottom 0.203: v25.3,14.87 25.29,14.86 17.51,14.86 13.95,11.3 9.05,11.3 v7.7,12.65
RFID_SCK  (via drill 0.3)
  Top 0.203: v26.25,16.35 26,16.6 U1.12
  Top 0.25: U3.29 11.11,17.15 11.61,17.64 v11.96,17.64
  Bottom 0.203: v11.96,17.64 12.36,17.64 13.75,16.25 26.15,16.25 v26.25,16.35
RFID_SDA
  Top 0.203: U1.20 25.4,21.6 23.25,19.45 21.5,19.45 19.4,17.35 14.6,17.35 13.81,16.56 U3.24
RX
  Top 0.254: U3.17 14.24,12.45 14.5,12.19 14.5,11.36 16.4,9.46 R20.2 R21.1
S2
  Top 0.203: U6.6 31.36,18.84 30.5,19.7 30.5,20.6 28.5,22.6 U1.22
S3  (via drill 0.35)
  Top 0.203: U1.23 29.7,23.1 v31.06,21.74 v31.07,21.74 | U6.7 33.22,17.57 v33.25,17.6
  Bottom 0.203: v31.07,21.74 v31.07,21.73 33.65,19.15 33.65,18 v33.25,17.6
SBT
  Top 0.203: U1.24 30.55,23.6 31.9,22.25 U6.5
SPEAK+  (via drill 0.35)
  Top 0.305: v43.7,21.35 43.51,21.54 U7.5 44.88,22.23 45.3,22.65 45.3,24.55 R16.1 | v46.95,16.6 46.97,16.6 47.95,15.62 J5.1
  Bottom 0.305: v46.95,16.6 46.69,16.86 46.69,18.36 v43.7,21.35
SPEAK-  (via drill 0.35)
  Top 0.305: v44.6,24.1 44.52,24.18 U7.8 | J5.2 48.27,16.88 47.3,17.85 v47.3,18.55
  Bottom 0.305: v44.6,24.1 47.3,21.4 v47.3,18.55
SYS_SWCLK  (via drill 0.35 pad 0.45)
  Top 0.203: U1.36 v19.45,25.1
  Bottom 0.203: v19.45,25.1 17.4,25.1 12.49,30.01 3.26,30.01 3.25,30 1.85,30 J3.4
SYS_SWDIO  (via drill 0.35 pad 0.45)
  Top 0.203: U1.35 20.52,24.52 20.25,24.25 19.04,24.25 v18.85,24.44
  Bottom 0.203: v18.85,24.44 17.06,24.44 11.9,29.6 11.2,29.6 3.99,29.6 2.57,28.18 J3.3
SYSTEM_RESET
  Top 0.203: R18.2 25.25,13.11 C30.1 24.02,14.42 U1.9
  Top 0.305: R18.2 R19.1
TOUCH_I2C_EN  (via drill 0.35 pad 0.45)
  Top 0.203: U2.21 15.11,28.42 15.11,26.38 14.03,25.3 v12.15,25.3 9.64,25.3 5.77,29.17 5.77,29.94 R10.2 | U1.45 15.86,19.6 v15.68,19.78
  Bottom 0.203: v15.68,19.78 12.15,23.31 v12.15,25.3
TOUCH_INT  (via drill 0.35 pad 0.45)
  Top 0.203: U2.20 14.61,28.42 14.61,26.95 13.61,25.95 v11.44,25.95 9.62,25.95 6.58,28.99 6.58,30.74 R9.2 | v15.1,19.35 15.35,19.1 U1.46
  Bottom 0.203: v11.44,25.95 11.44,23 15,19.44 15.01,19.44 v15.1,19.35
TOUCH_OUT1  (via drill 0.35 pad 0.45)
  Top 0.203: U2.17 12.91,28.22 v11.5,28.22 9.18,28.22 7.9,29.5 7.9,34.6 6.25,36.25 R2.2 | v16.25,20.25 16.4,20.1 U1.44
  Bottom 0.203: v11.5,28.22 12.75,26.97 12.75,23.75 v16.25,20.25
TOUCH_SCL  (via drill 0.35 pad 0.45)
  Top 0.203: U2.18 13.66,27.91 13.25,27.5 v11.1,27.5 v11.09,27.51 9.31,27.51 7.49,29.33 7.49,33.67 6.46,34.7 R5.2 | v14.55,18.9 14.85,18.6 U1.47
  Bottom 0.203: v14.55,18.9 10.81,22.64 10.81,27.21 v11.1,27.5
TOUCH_SDA  (via drill 0.35 pad 0.45)
  Top 0.203: U2.19 14.11,28.42 14.11,27.78 13.08,26.75 v10.2,26.75 9.4,26.75 7.03,29.12 7.03,31.89 7.02,31.89 R7.2 | v13.97,18.48 14.35,18.1 U1.48
  Bottom 0.203: v13.97,18.48 10.2,22.25 v10.2,26.75
TSM_RESET  (via drill 0.35 pad 0.45)
  Top 0.203: v10.75,29.02 10.89,29.17 U2.16 | v20,23.19 19.1,23.19 19.01,23.1 U1.38
  Bottom 0.203: v10.75,29.02 11.73,29.02 17.56,23.19 v20,23.19
TX1
  Top 0.254: U3.11 10.61,10.91 9.95,10.25 L1.1
TX2
  Top 0.254: U3.13 11.61,11.04 12.25,10.4 L2.1
VCC  (via drill 0.35)
  Top 0.305: FB1.1 41.23,17.74 v41.17,17.8 | R23.1 36.66,29.05 v35.9,29.05 34.93,29.05 T2.2
  Top 0.406: U4.5 44.75,12.3 45.38,12.93 C25.+ 42.39,17.74 FB1.1
  Bottom 0.305: v41.17,17.8 41.17,17.86 35.9,23.13 v35.9,29.05
VIN
  Top 0.508: J6.2 45.97,6.25 D2.A D1.A
VMID
  Top 0.254: R20.1 16.29,7.58 14.62,7.58 C17.2 14.43,7.6 13.58,8.45 13.58,10.97 13.11,11.44 U3.16
VOUT2
  Top 0.254: U6.2 37.6,17.57 39.26,19.23 44.64,19.23 C3.2 49.95,22.45 R11.1
WBR1_EN
  Top 0.203: U1.15 27.73,19.1 29,17.83 29,9.36 30.58,7.78 30.58,7.34 J4.5
WBR1_RX
  Top 0.203: J4.4 29.34,7.33 29.34,8.39 28.51,9.22 28.51,17.66 27.57,18.6 U1.14
WBR1_TX
  Top 0.203: U1.13 27.42,18.1 28.08,17.44 28.08,7.35 J4.3

### Text on the board
Top: Smart_Lock_V1.00
tPlace: MOTOR | NRST | CLK | DIO | 3V3 | GND | + | TYP-C IN | BARFAS | TUYA
bPlace: - | - | - | - | NRST | CLK | DIO | +3V3 | GND | - | - | - | - | - | - | - | -
tStop: Smart_Lock_V1.00
_tNames: R2 | C1 | C2 | R6 | R4 | U5 | J1 | J3 | R5 | U2 | T3 | R7 | R9 | R8 | T4 | R3 | C32 | C19 | T1 | R10 | T2 | R30 | R26 | R22 | C26 | C5 | R29 | R16 | R14 | R12 | R13 | R15 | R23 | U1 | C6 | U7 | R28 | C34 | R27 | C35 | C4 | C3 | U6 | C7 | R11 | J2 | J5 | FB1 | U3 | C21 | Q1 | C28 | R17 | C27 | C29 | C30 | C25 | C14 | C22 | U4 | L1 | L2 | C20 | R19 | R18 | R25 | R24 | J6 | C23 | R1 | D3 | D1 | D2 | C17 | R20 | R21 | C11 | J4 | C15 | C18 | C12 | C9 | C10 | C13 | C8 | C16
_bNames: D19 | R40 | R37 | D16 | R47 | R43 | D11 | D7 | D5 | D18 | D14 | D10 | D6 | D9 | R46 | R42 | R36 | D12 | R39 | D15 | D13 | D8 | D4 | D17 | R31 | R32 | R44 | PAD13 | PAD14 | PAD15 | R34 | R38 | R35 | R33
_tFinish: C1 | C2 | C19 | C32 | C26 | C5 | C6 | C34 | C4 | C3 | C35 | C7 | C28 | C14 | C29 | C30 | C23 | C11 | C22